# EAGLE design MotherboardRev1 (EAGLE 7.2.0)

## Sheet 1 of 9
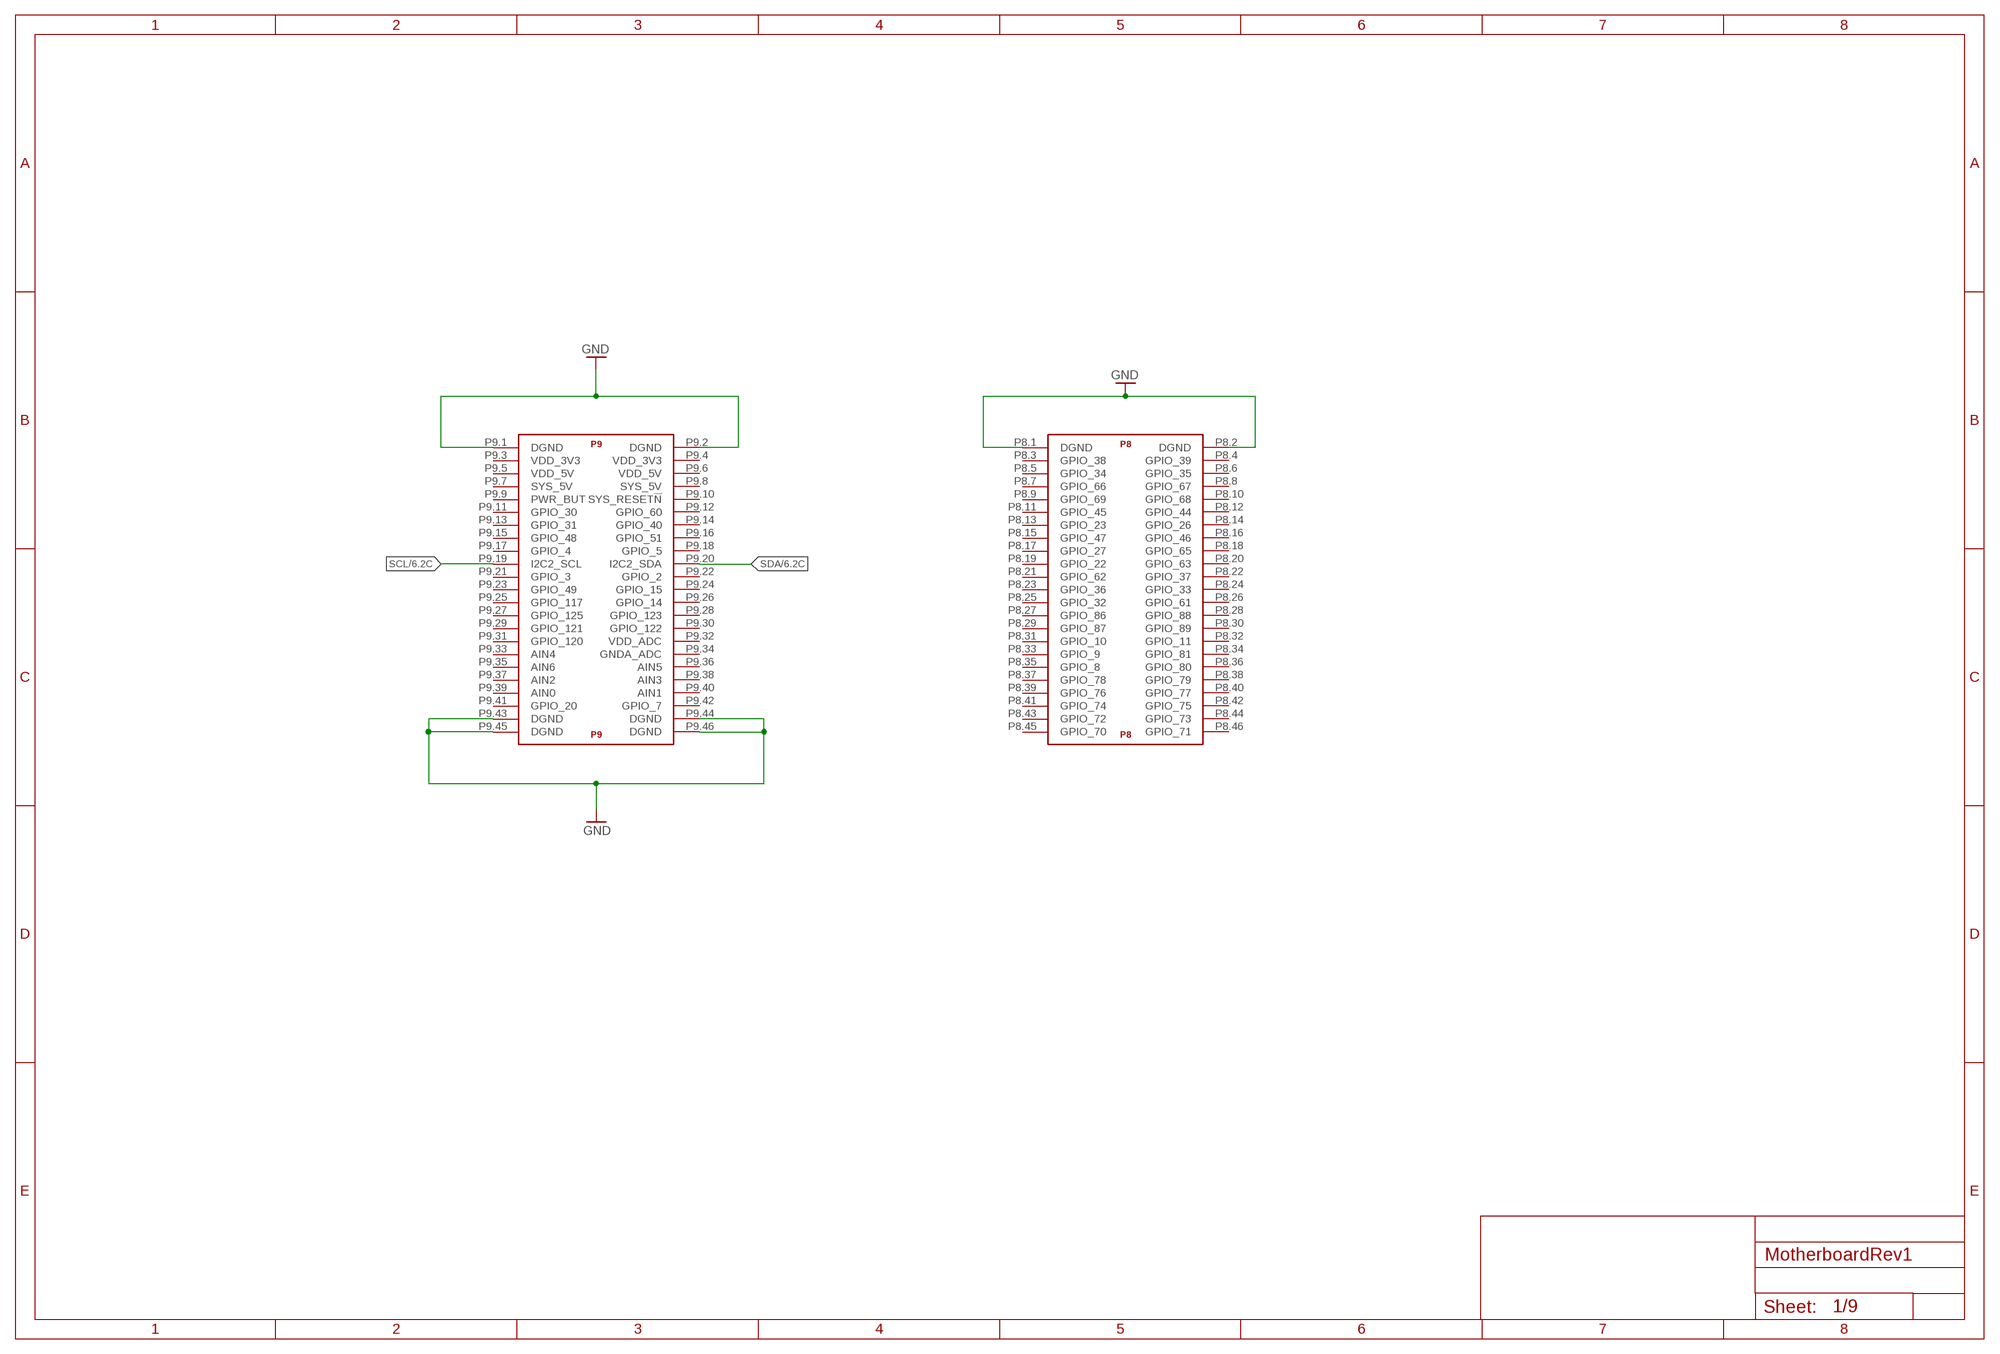
[diagram p0: schematic, sheet 1]

### Parts
U$1  BEAGLE_BONE_BLACK_CAPE  [BEAGLE_BONE_BLACK_CAPE]

### Nets
GND: U$1.P8.1(P8:DGND) U$1.P8.2(P8:DGND) U$1.P9.1(P9:DGND) U$1.P9.2(P9:DGND) U$1.P9.43(P9:DGND) U$1.P9.44(P9:DGND) U$1.P9.45(P9:DGND) U$1.P9.46(P9:DGND) ; also sheet 2,3,4,5,6,8,9
SCL: U$1.P9.19(P9:I2C2_SCL) ; also sheet 6,9
SDA: U$1.P9.20(P9:I2C2_SDA) ; also sheet 6,9
Unconnected: U$1.P8.3(P8:GPIO_38) U$1.P8.4(P8:GPIO_39) U$1.P8.5(P8:GPIO_34) U$1.P8.6(P8:GPIO_35) U$1.P8.7(P8:GPIO_66) U$1.P8.8(P8:GPIO_67) U$1.P8.9(P8:GPIO_69) U$1.P8.10(P8:GPIO_68) U$1.P8.11(P8:GPIO_45) U$1.P8.12(P8:GPIO_44) U$1.P8.13(P8:GPIO_23) U$1.P8.14(P8:GPIO_26) U$1.P8.15(P8:GPIO_47) U$1.P8.16(P8:GPIO_46) U$1.P8.17(P8:GPIO_27) U$1.P8.18(P8:GPIO_65) U$1.P8.19(P8:GPIO_22) U$1.P8.20(P8:GPIO_63) U$1.P8.21(P8:GPIO_62) U$1.P8.22(P8:GPIO_37) U$1.P8.23(P8:GPIO_36) U$1.P8.24(P8:GPIO_33) U$1.P8.25(P8:GPIO_32) U$1.P8.26(P8:GPIO_61) U$1.P8.27(P8:GPIO_86) U$1.P8.28(P8:GPIO_88) U$1.P8.29(P8:GPIO_87) U$1.P8.30(P8:GPIO_89) U$1.P8.31(P8:GPIO_10) U$1.P8.32(P8:GPIO_11) U$1.P8.33(P8:GPIO_9) U$1.P8.34(P8:GPIO_81) U$1.P8.35(P8:GPIO_8) U$1.P8.36(P8:GPIO_80) U$1.P8.37(P8:GPIO_78) U$1.P8.38(P8:GPIO_79) U$1.P8.39(P8:GPIO_76) U$1.P8.40(P8:GPIO_77) U$1.P8.41(P8:GPIO_74) U$1.P8.42(P8:GPIO_75) U$1.P8.43(P8:GPIO_72) U$1.P8.44(P8:GPIO_73) U$1.P8.45(P8:GPIO_70) U$1.P8.46(P8:GPIO_71) U$1.P9.3(P9:VDD_3V3) U$1.P9.4(P9:VDD_3V3) U$1.P9.5(P9:VDD_5V) U$1.P9.6(P9:VDD_5V) U$1.P9.7(P9:SYS_5V) U$1.P9.8(P9:SYS_5V) U$1.P9.9(P9:PWR_BUT) U$1.P9.10(P9:SYS_RESET!N) U$1.P9.11(P9:GPIO_30) U$1.P9.12(P9:GPIO_60) U$1.P9.13(P9:GPIO_31) U$1.P9.14(P9:GPIO_40) U$1.P9.15(P9:GPIO_48) U$1.P9.16(P9:GPIO_51) U$1.P9.17(P9:GPIO_4) U$1.P9.18(P9:GPIO_5) U$1.P9.21(P9:GPIO_3) U$1.P9.22(P9:GPIO_2) U$1.P9.23(P9:GPIO_49) U$1.P9.24(P9:GPIO_15) U$1.P9.25(P9:GPIO_117) U$1.P9.26(P9:GPIO_14) U$1.P9.27(P9:GPIO_125) U$1.P9.28(P9:GPIO_123) U$1.P9.29(P9:GPIO_121) U$1.P9.30(P9:GPIO_122) U$1.P9.31(P9:GPIO_120) U$1.P9.32(P9:VDD_ADC) U$1.P9.33(P9:AIN4) U$1.P9.34(P9:GNDA_ADC) U$1.P9.35(P9:AIN6) U$1.P9.36(P9:AIN5) U$1.P9.37(P9:AIN2) U$1.P9.38(P9:AIN3) U$1.P9.39(P9:AIN0) U$1.P9.40(P9:AIN1) U$1.P9.41(P9:GPIO_20) U$1.P9.42(P9:GPIO_7)

## Sheet 2 of 9
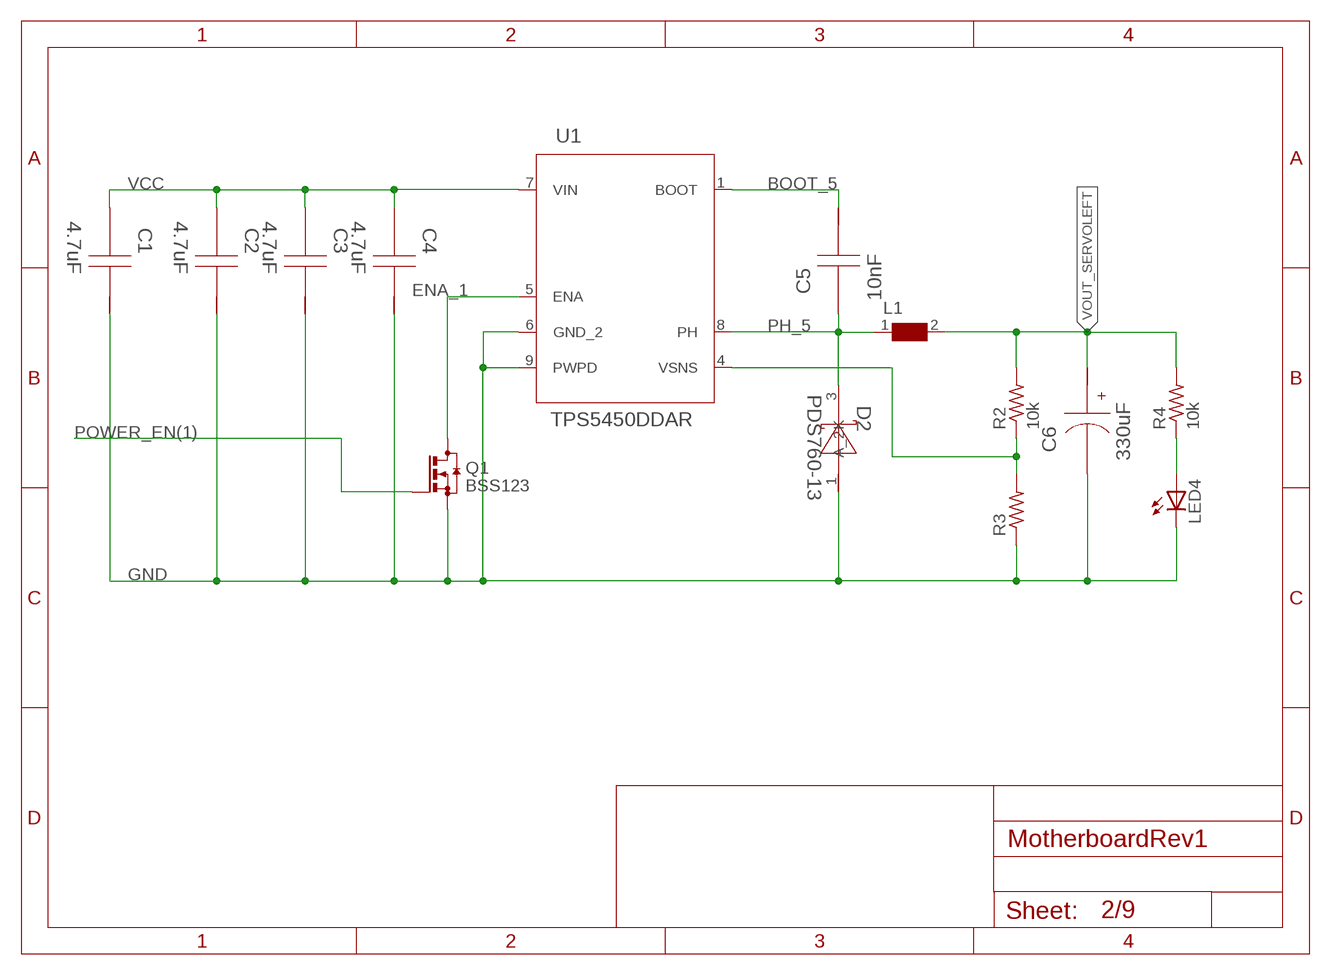
[diagram p1: schematic, sheet 2]

### Parts
C1  4.7uF  GRM31CR71H475KA12L  [1206]
C2  4.7uF  GRM31CR71H475KA12L  [1206]
C3  4.7uF  GRM31CR71H475KA12L  [1206]
C4  4.7uF  GRM31CR71H475KA12L  [1206]
C5  10nF  C0805C103K5RACTU  [0805]
C6  330uF  10SVP330MX  [SM_RADIAL_10AMM]
D2  PDS760-13  [POWERDI5]
L1  WE-HCC-7443331000_1090  [WE-HCC_1090]
LED4  LEDSML1206  [SML1206]
Q1  BSS123  [SOT23]
R2  10k  R-US_R1206  [R1206]
R3  R-US_R1206  [R1206]
R4  10k  R-US_R1206  [R1206]
U1  TPS5450DDAR  [R-PDSO-G8]

### Nets
BOOT_5: C5.1 U1.1(BOOT) ; also sheet 4
ENA_1: Q1.3(D) U1.5(ENA)
GND: C1.1 C2.1 C3.1 C4.1 C6.2(-) D2.1(A_2) LED4.C Q1.2(S) R3.1 U1.6(GND_2) U1.9(PWPD) ; also sheet 1,3,4,5,6,8,9
N$2: LED4.A R4.1
PH_5: C5.2 D2.3(K) L1.1 U1.8(PH) ; also sheet 4
POWER_EN(1): Q1.1(G)
VCC: C1.2 C2.2 C3.2 C4.2 U1.7(VIN) ; also sheet 3,4,5
VOUT_SERVOLEFT: C6.1(+) L1.2 R2.2 R4.2 ; also sheet 8
VSNS_5: R2.1 R3.2 U1.4(VSNS)

## Sheet 3 of 9
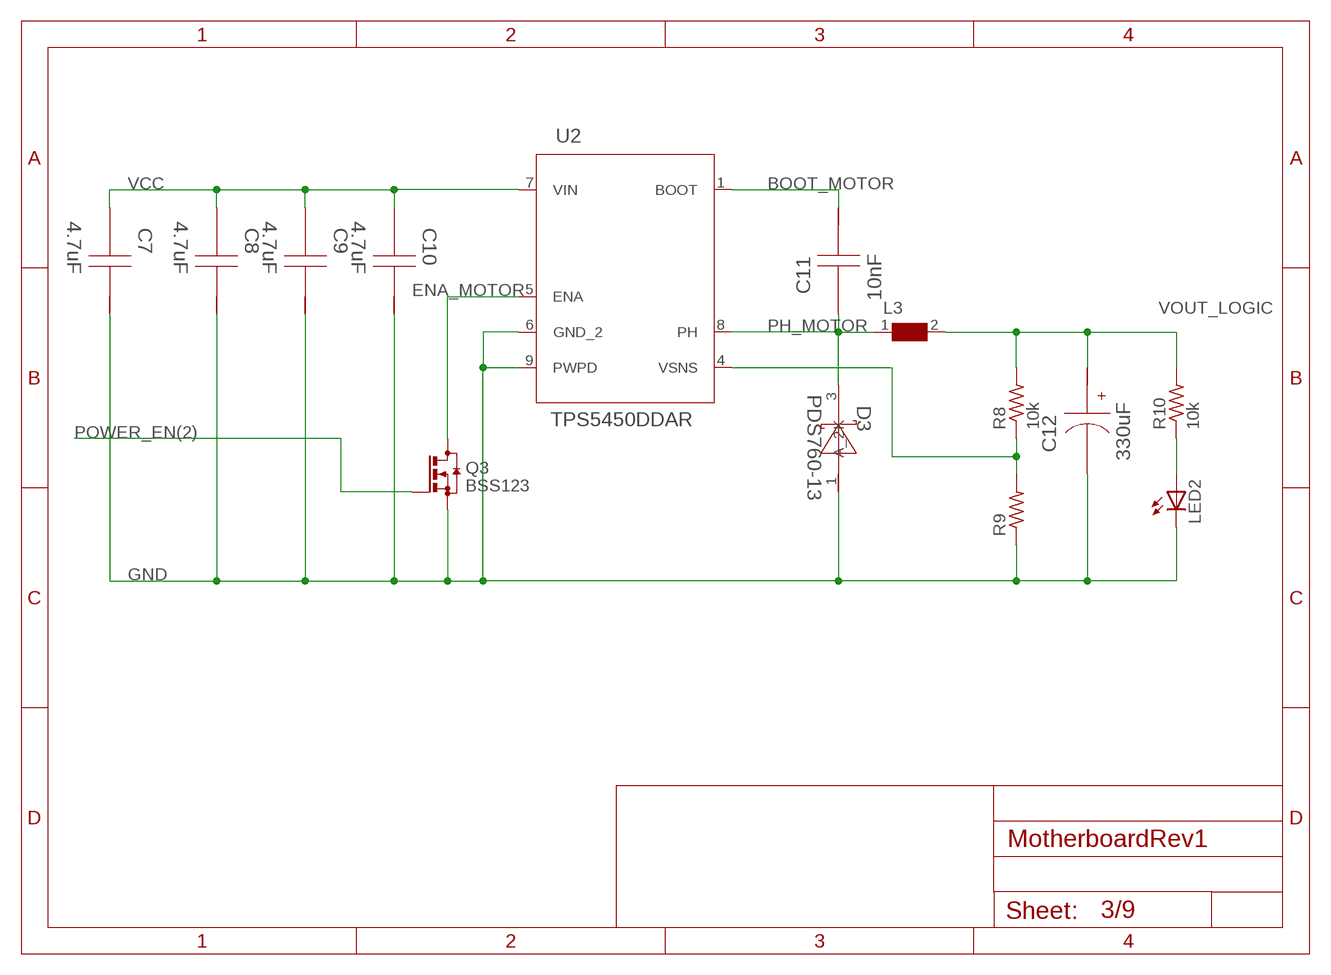
[diagram p2: schematic, sheet 3]

### Parts
C7  4.7uF  GRM31CR71H475KA12L  [1206]
C8  4.7uF  GRM31CR71H475KA12L  [1206]
C9  4.7uF  GRM31CR71H475KA12L  [1206]
C10  4.7uF  GRM31CR71H475KA12L  [1206]
C11  10nF  C0805C103K5RACTU  [0805]
C12  330uF  10SVP330MX  [SM_RADIAL_10AMM]
D3  PDS760-13  [POWERDI5]
L3  WE-HCC-7443331000_1090  [WE-HCC_1090]
LED2  LEDSML1206  [SML1206]
Q3  BSS123  [SOT23]
R8  10k  R-US_R1206  [R1206]
R9  R-US_R1206  [R1206]
R10  10k  R-US_R1206  [R1206]
U2  TPS5450DDAR  [R-PDSO-G8]

### Nets
BOOT_MOTOR: C11.1 U2.1(BOOT) ; also sheet 5
ENA_MOTOR: Q3.3(D) U2.5(ENA) ; also sheet 5
GND: C7.1 C8.1 C9.1 C10.1 C12.2(-) D3.1(A_2) LED2.C Q3.2(S) R9.1 U2.6(GND_2) U2.9(PWPD) ; also sheet 1,2,4,5,6,8,9
N$4: LED2.A R10.1
PH_MOTOR: C11.2 D3.3(K) L3.1 U2.8(PH) ; also sheet 5
POWER_EN(2): Q3.1(G)
VCC: C7.2 C8.2 C9.2 C10.2 U2.7(VIN) ; also sheet 2,4,5
VOUT_LOGIC: C12.1(+) L3.2 R8.2 R10.2
VSNS1_MOTOR: R8.1 R9.2 U2.4(VSNS)

## Sheet 4 of 9
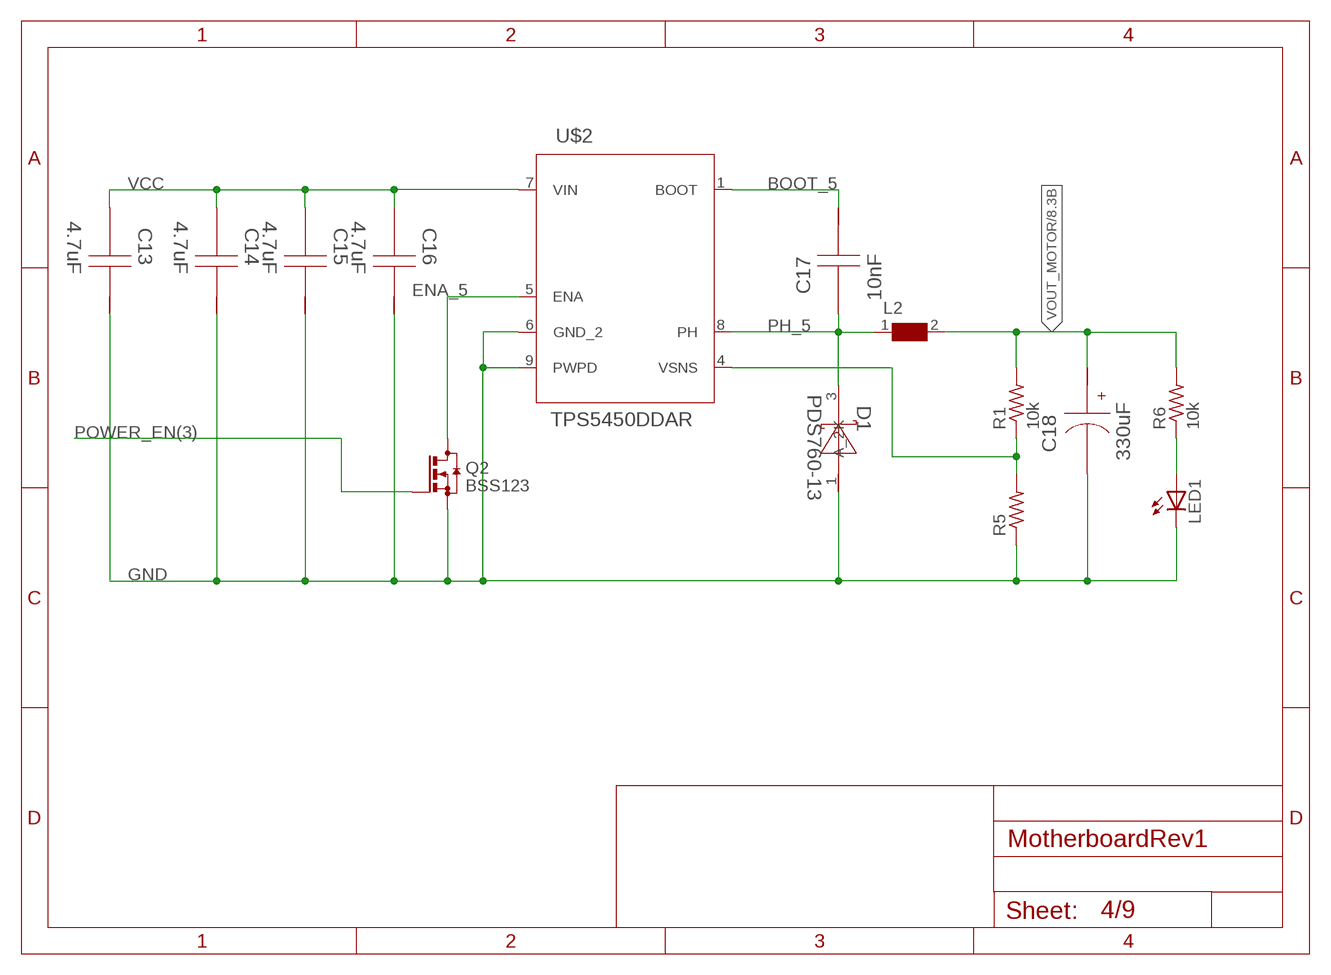
[diagram p3: schematic, sheet 4]

### Parts
C13  4.7uF  GRM31CR71H475KA12L  [1206]
C14  4.7uF  GRM31CR71H475KA12L  [1206]
C15  4.7uF  GRM31CR71H475KA12L  [1206]
C16  4.7uF  GRM31CR71H475KA12L  [1206]
C17  10nF  C0805C103K5RACTU  [0805]
C18  330uF  10SVP330MX  [SM_RADIAL_10AMM]
D1  PDS760-13  [POWERDI5]
L2  WE-HCC-7443331000_1090  [WE-HCC_1090]
LED1  LEDSML1206  [SML1206]
Q2  BSS123  [SOT23]
R1  10k  R-US_R1206  [R1206]
R5  R-US_R1206  [R1206]
R6  10k  R-US_R1206  [R1206]
U$2  TPS5450DDAR  [R-PDSO-G8]

### Nets
BOOT_5: C17.1 U$2.1(BOOT) ; also sheet 2
ENA_5: Q2.3(D) U$2.5(ENA)
GND: C13.1 C14.1 C15.1 C16.1 C18.2(-) D1.1(A_2) LED1.C Q2.2(S) R5.1 U$2.6(GND_2) U$2.9(PWPD) ; also sheet 1,2,3,5,6,8,9
N$1: LED1.A R6.1
PH_5: C17.2 D1.3(K) L2.1 U$2.8(PH) ; also sheet 2
POWER_EN(3): Q2.1(G)
VCC: C13.2 C14.2 C15.2 C16.2 U$2.7(VIN) ; also sheet 2,3,5
VOUT_MOTOR: C18.1(+) L2.2 R1.2 R6.2 ; also sheet 8
VSNS_1: R1.1 R5.2 U$2.4(VSNS)

## Sheet 5 of 9
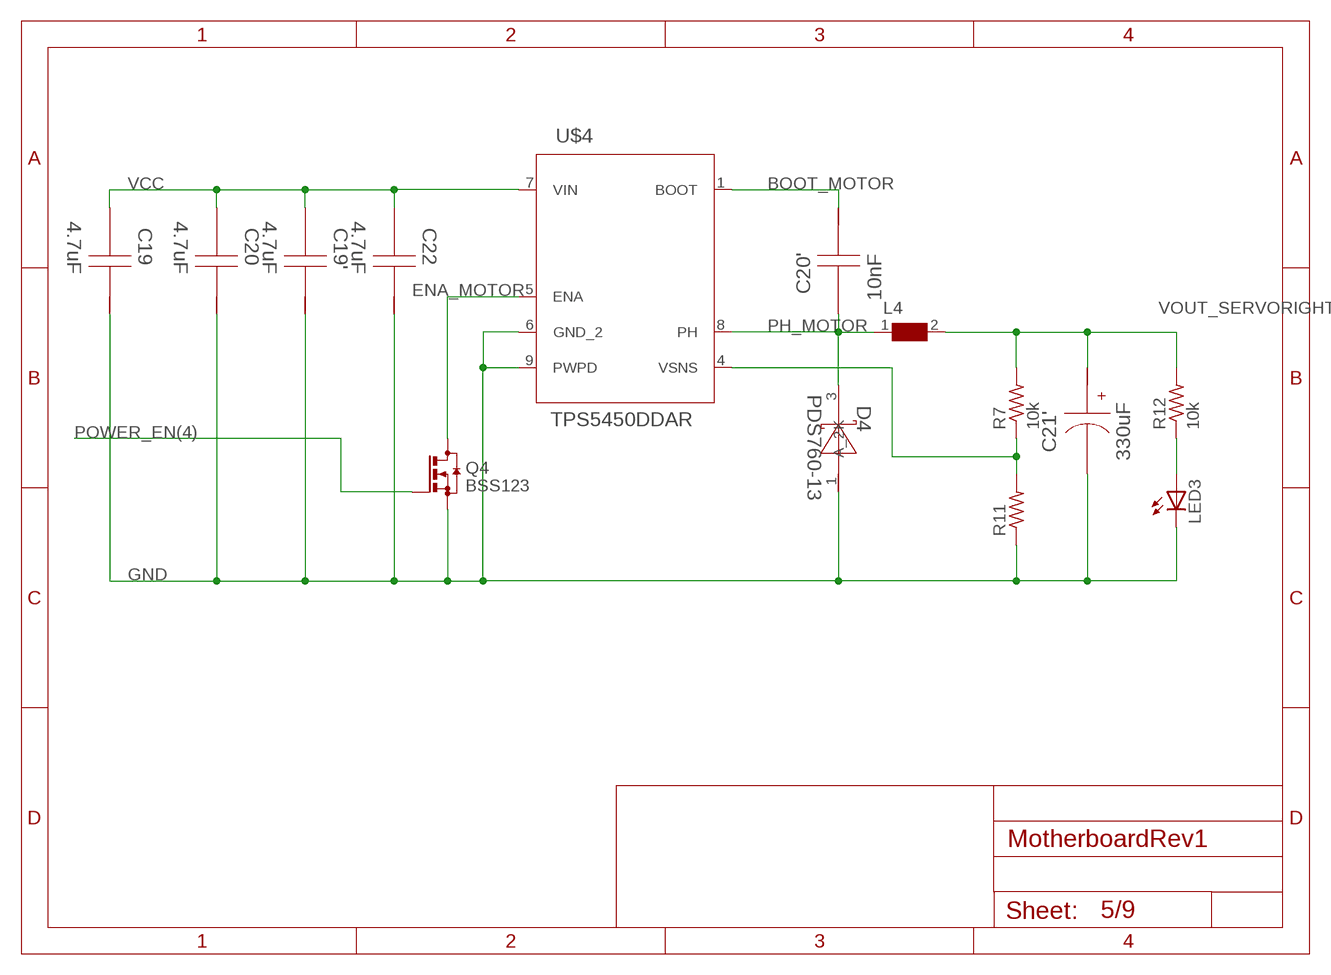
[diagram p4: schematic, sheet 5]

### Parts
C19  4.7uF  GRM31CR71H475KA12L  [1206]
C19'  4.7uF  GRM31CR71H475KA12L  [1206]
C20  4.7uF  GRM31CR71H475KA12L  [1206]
C20'  10nF  C0805C103K5RACTU  [0805]
C21'  330uF  10SVP330MX  [SM_RADIAL_10AMM]
C22  4.7uF  GRM31CR71H475KA12L  [1206]
D4  PDS760-13  [POWERDI5]
L4  WE-HCC-7443331000_1090  [WE-HCC_1090]
LED3  LEDSML1206  [SML1206]
Q4  BSS123  [SOT23]
R7  10k  R-US_R1206  [R1206]
R11  R-US_R1206  [R1206]
R12  10k  R-US_R1206  [R1206]
U$4  TPS5450DDAR  [R-PDSO-G8]

### Nets
BOOT_MOTOR: C20'.1 U$4.1(BOOT) ; also sheet 3
ENA_MOTOR: Q4.3(D) U$4.5(ENA) ; also sheet 3
GND: C19'.1 C19.1 C20.1 C21'.2(-) C22.1 D4.1(A_2) LED3.C Q4.2(S) R11.1 U$4.6(GND_2) U$4.9(PWPD) ; also sheet 1,2,3,4,6,8,9
N$3: LED3.A R12.1
PH_MOTOR: C20'.2 D4.3(K) L4.1 U$4.8(PH) ; also sheet 3
POWER_EN(4): Q4.1(G)
VCC: C19'.2 C19.2 C20.2 C22.2 U$4.7(VIN) ; also sheet 2,3,4
VOUT_SERVORIGHT: C21'.1(+) L4.2 R7.2 R12.2 ; also sheet 8
VSNS1_MOTOR1: R7.1 R11.2 U$4.4(VSNS)

## Sheet 6 of 9
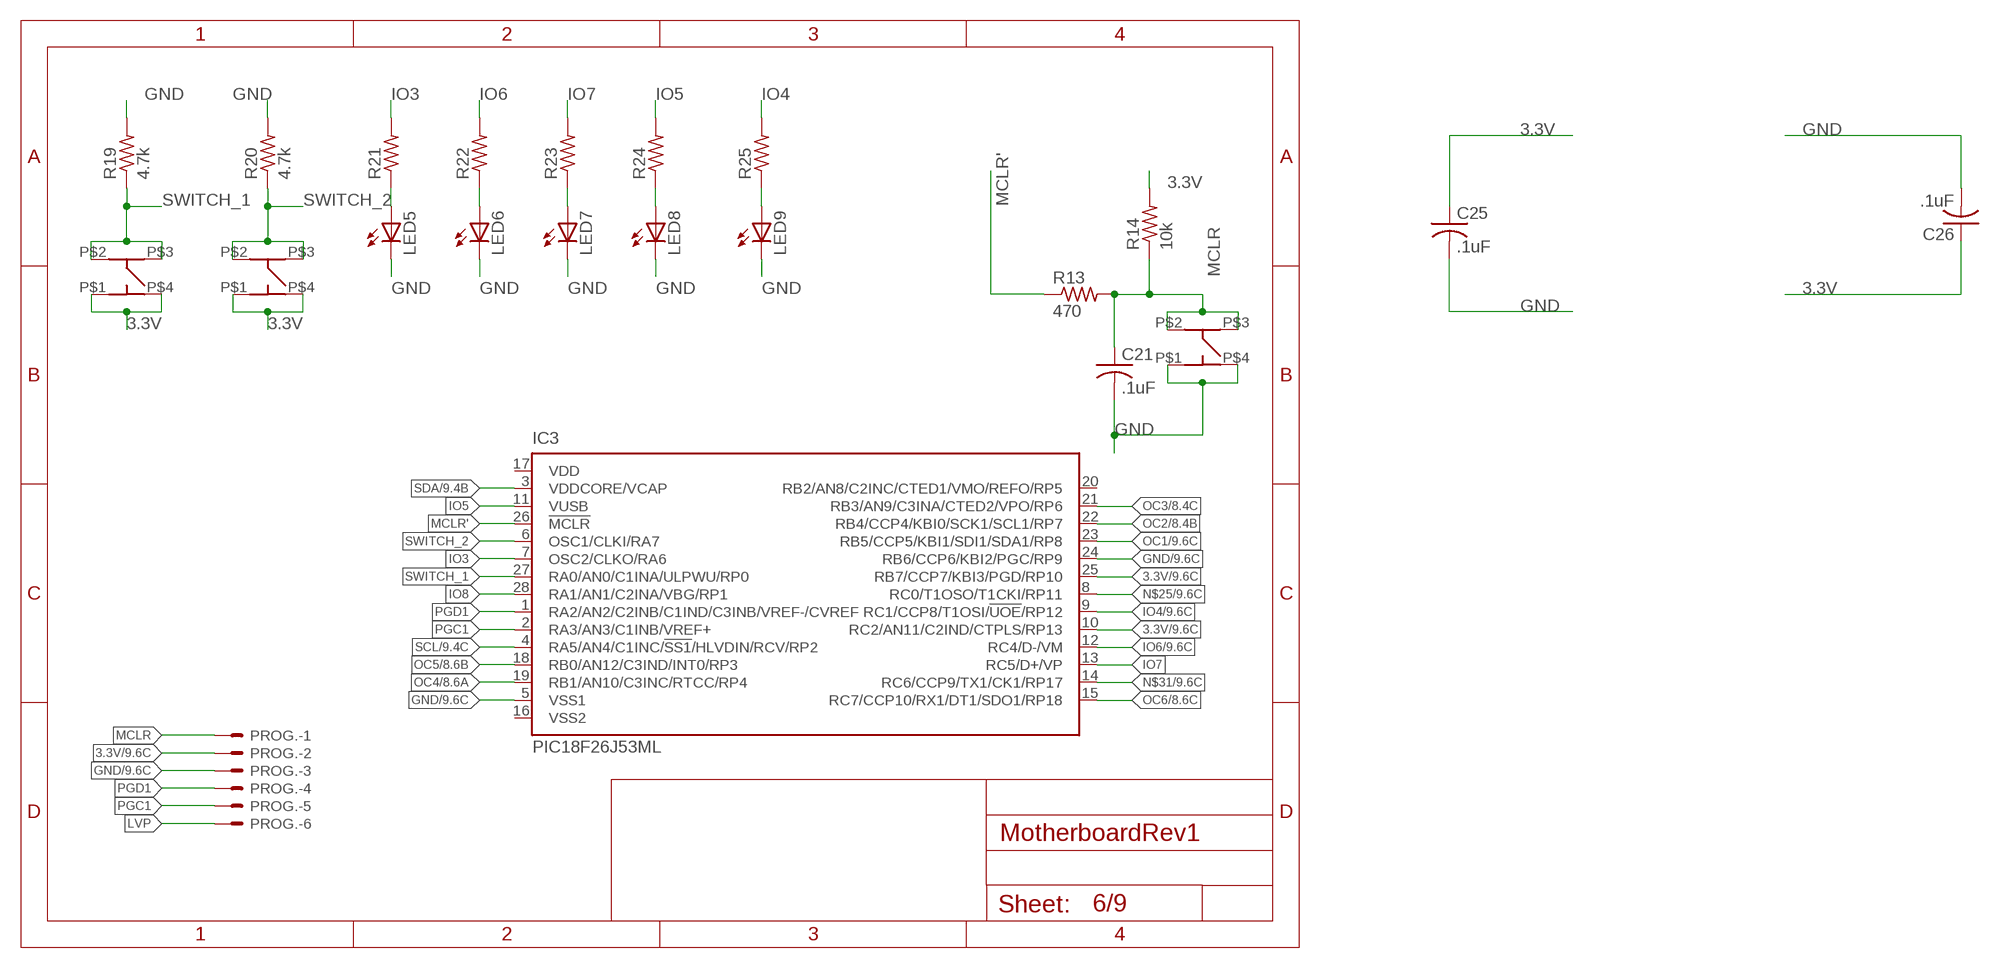
[diagram p5: schematic, sheet 6]

### Parts
C21  .1uF  C-USC0805  [C0805]
C25  .1uF  C-USC0805  [C0805]
C26  .1uF  C-USC0805  [C0805]
IC3  PIC18F26J53ML  [QFN28-ML_6X6MM]
LED5  LED_LEDCHIPLED_1206  [LED_CHIPLED_1206]
LED6  LED_LEDCHIPLED_1206  [LED_CHIPLED_1206]
LED7  LED_LEDCHIPLED_1206  [LED_CHIPLED_1206]
LED8  LED_LEDCHIPLED_1206  [LED_CHIPLED_1206]
LED9  LED_LEDCHIPLED_1206  [LED_CHIPLED_1206]
PROG.  22-23-2061  [22-23-2061]
R13  470  R-US_R0805  [R0805]
R14  10k  R-US_R0805  [R0805]
R19  4.7k  R-US_R0805  [R0805]
R20  4.7k  R-US_R0805  [R0805]
R21  R-US_M0805  [M0805]
R22  R-US_M0805  [M0805]
R23  R-US_M0805  [M0805]
R24  R-US_M0805  [M0805]
R25  R-US_M0805  [M0805]
U$5  Switch3  MC32882_SW  [MC32882_FINAL]
U$6  Switch1  MC32882_SW  [MC32882_FINAL]
U$7  Switch2  MC32882_SW  [MC32882_FINAL]

### Nets
3.3V: C25.1 C26.1 IC3.10(RC2/AN11/C2IND/CTPLS/RP13) IC3.25(RB7/CCP7/KBI3/PGD/RP10) PROG..2 R14.2 U$6.P$1(P1) U$6.P$4(P4) U$7.P$1(P1) U$7.P$4(P4) ; also sheet 7,9
GND: C21.2 C25.2 C26.2 IC3.5(VSS1) IC3.24(RB6/CCP6/KBI2/PGC/RP9) LED5.C LED6.C LED7.C LED8.C LED9.C PROG..3 R19.2 R20.2 U$5.P$1(P1) U$5.P$4(P4) ; also sheet 1,2,3,4,5,8,9
IO3: IC3.7(OSC2/CLKO/RA6) R21.2
IO4: IC3.9(RC1/CCP8/T1OSI/!UOE!/RP12) R25.2 ; also sheet 9
IO5: IC3.11(VUSB) R24.2
IO6: IC3.12(RC4/D-/VM) R22.2 ; also sheet 9
IO7: IC3.13(RC5/D+/VP) R23.2
IO8: IC3.28(RA1/AN1/C2INA/VBG/RP1)
LVP: PROG..6
MCLR: C21.1 PROG..1 R13.2 R14.1 U$5.P$2(P2) U$5.P$3(P3)
MCLR': IC3.26(!MCLR) R13.1
N$5: LED5.A R21.1
N$6: LED6.A R22.1
N$7: LED7.A R23.1
N$8: LED8.A R24.1
N$9: LED9.A R25.1
N$25: IC3.8(RC0/T1OSO/T1CKI/RP11) ; also sheet 9
N$31: IC3.14(RC6/CCP9/TX1/CK1/RP17) ; also sheet 9
OC1: IC3.23(RB5/CCP5/KBI1/SDI1/SDA1/RP8) ; also sheet 8,9
OC2: IC3.22(RB4/CCP4/KBI0/SCK1/SCL1/RP7) ; also sheet 8,9
OC3: IC3.21(RB3/AN9/C3INA/CTED2/VPO/RP6) ; also sheet 8,9
OC4: IC3.19(RB1/AN10/C3INC/RTCC/RP4) ; also sheet 8
OC5: IC3.18(RB0/AN12/C3IND/INT0/RP3) ; also sheet 8
OC6: IC3.15(RC7/CCP10/RX1/DT1/SDO1/RP18) ; also sheet 8
PGC1: IC3.2(RA3/AN3/C1INB/VREF+) PROG..5
PGD1: IC3.1(RA2/AN2/C2INB/C1IND/C3INB/VREF-/CVREF) PROG..4
SCL: IC3.4(RA5/AN4/C1INC/!SS1!/HLVDIN/RCV/RP2) ; also sheet 1,9
SDA: IC3.3(VDDCORE/VCAP) ; also sheet 1,9
SWITCH_1: IC3.27(RA0/AN0/C1INA/ULPWU/RP0) R19.1 U$6.P$2(P2) U$6.P$3(P3)
SWITCH_2: IC3.6(OSC1/CLKI/RA7) R20.1 U$7.P$2(P2) U$7.P$3(P3)
Unconnected: IC3.16(VSS2) IC3.17(VDD) IC3.20(RB2/AN8/C2INC/CTED1/VMO/REFO/RP5)

## Sheet 7 of 9: Power System
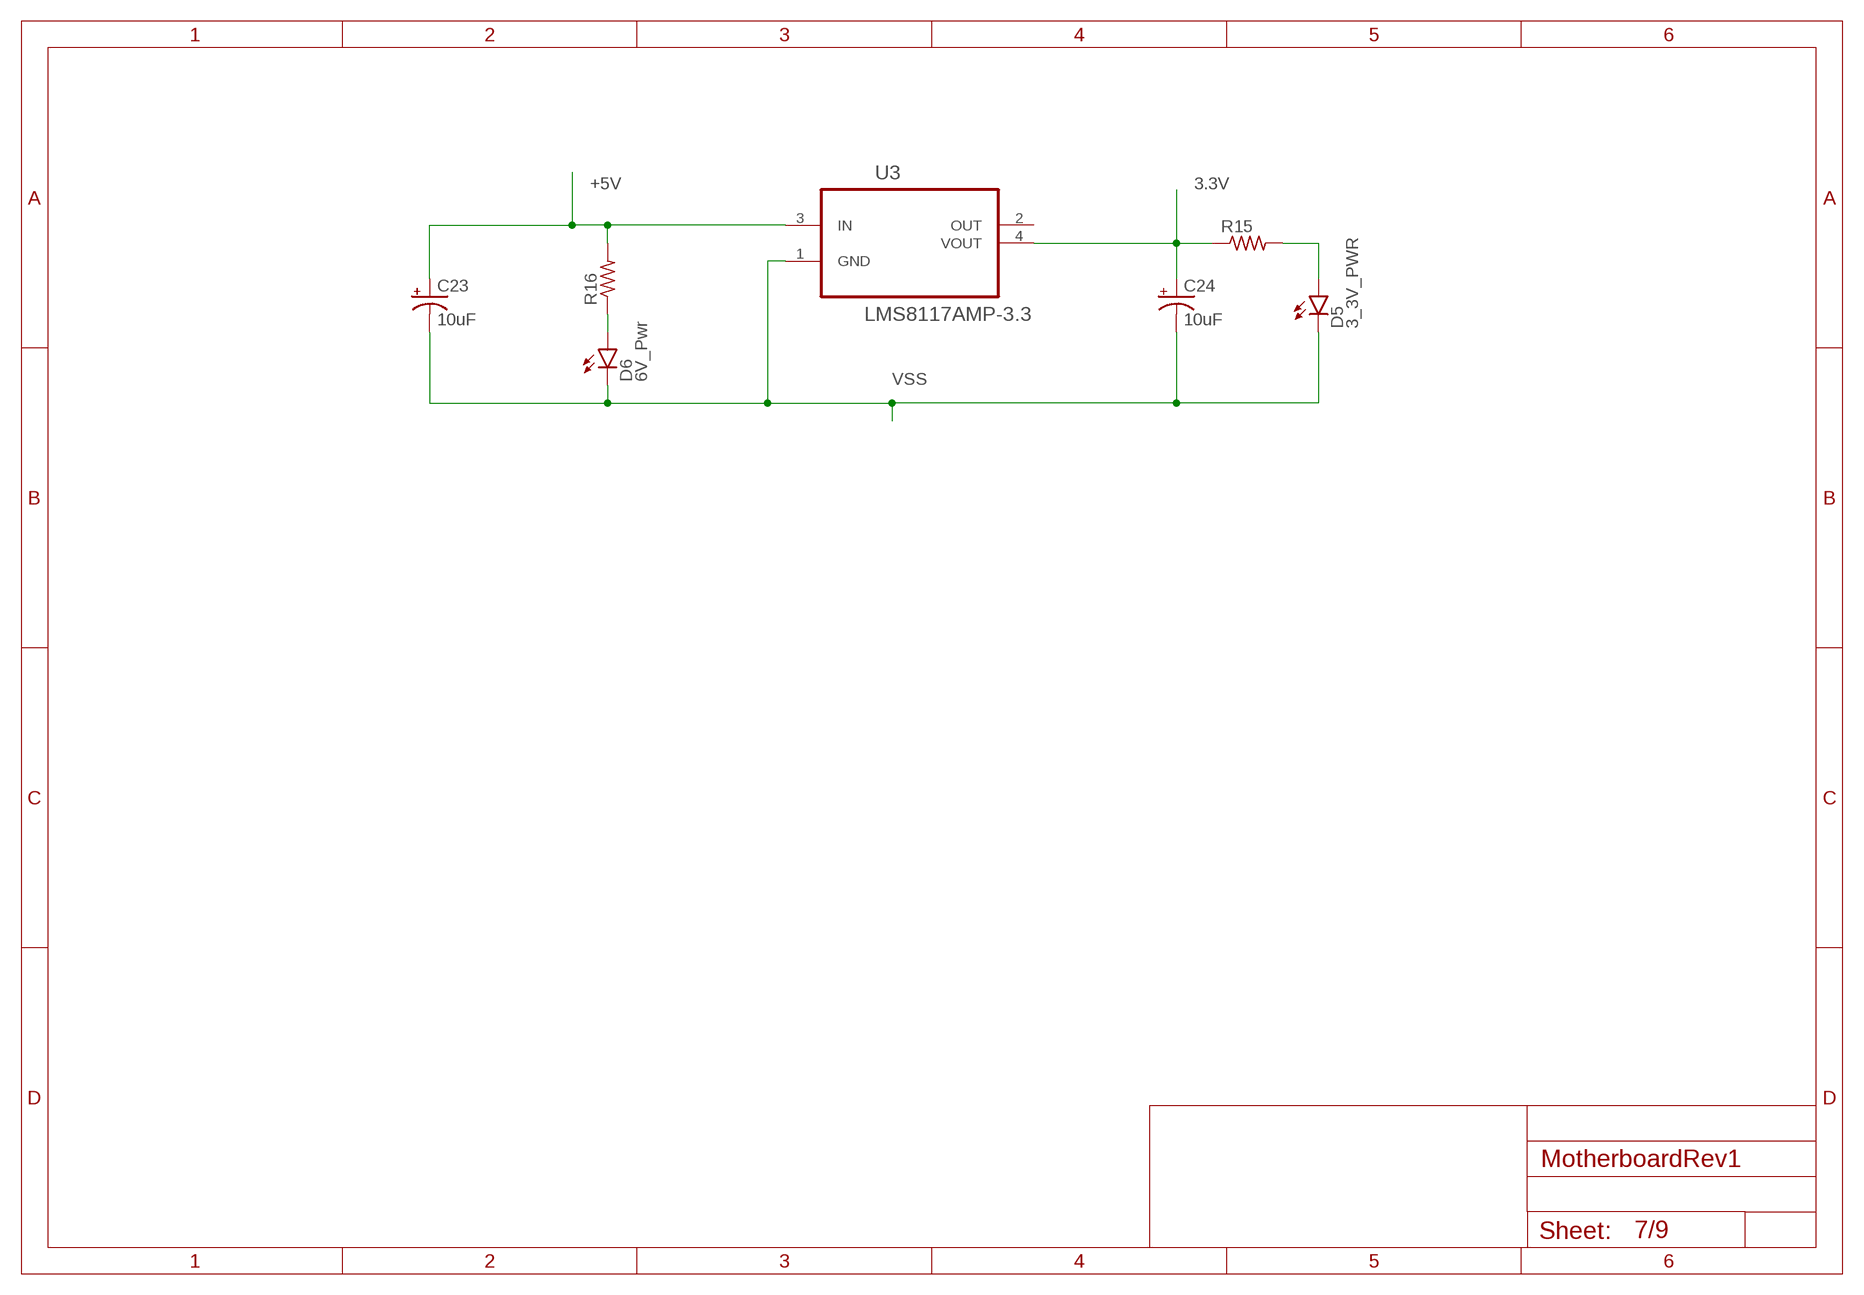
[diagram p6: schematic, sheet 7]

### Parts
C23  10uF  10UF-16V-10%(TANT)  [EIA3216]
C24  10uF  10UF-16V-10%(TANT)  [EIA3216]
D5  3_3V_PWR  LED-FKIT-1206  [FKIT-LED-1206]
D6  6V_Pwr  LED-FKIT-1206  [FKIT-LED-1206]
R15  R-US_R0805W  [R0805W]
R16  R-US_R0805W  [R0805W]
U3  LMS8117AMP-3.3  [SOT230P696X180-4N]

### Nets
3.3V: C24.A(+) R15.1 U3.4(VOUT) ; also sheet 6,9
+5V: C23.A(+) R16.2 U3.3(IN)
N$10: D5.A R15.2
N$13: D6.A R16.1
VSS: C23.C(-) C24.C(-) D5.C D6.C U3.1(GND) ; also sheet 8
Unconnected: U3.2(OUT)

## Sheet 8 of 9
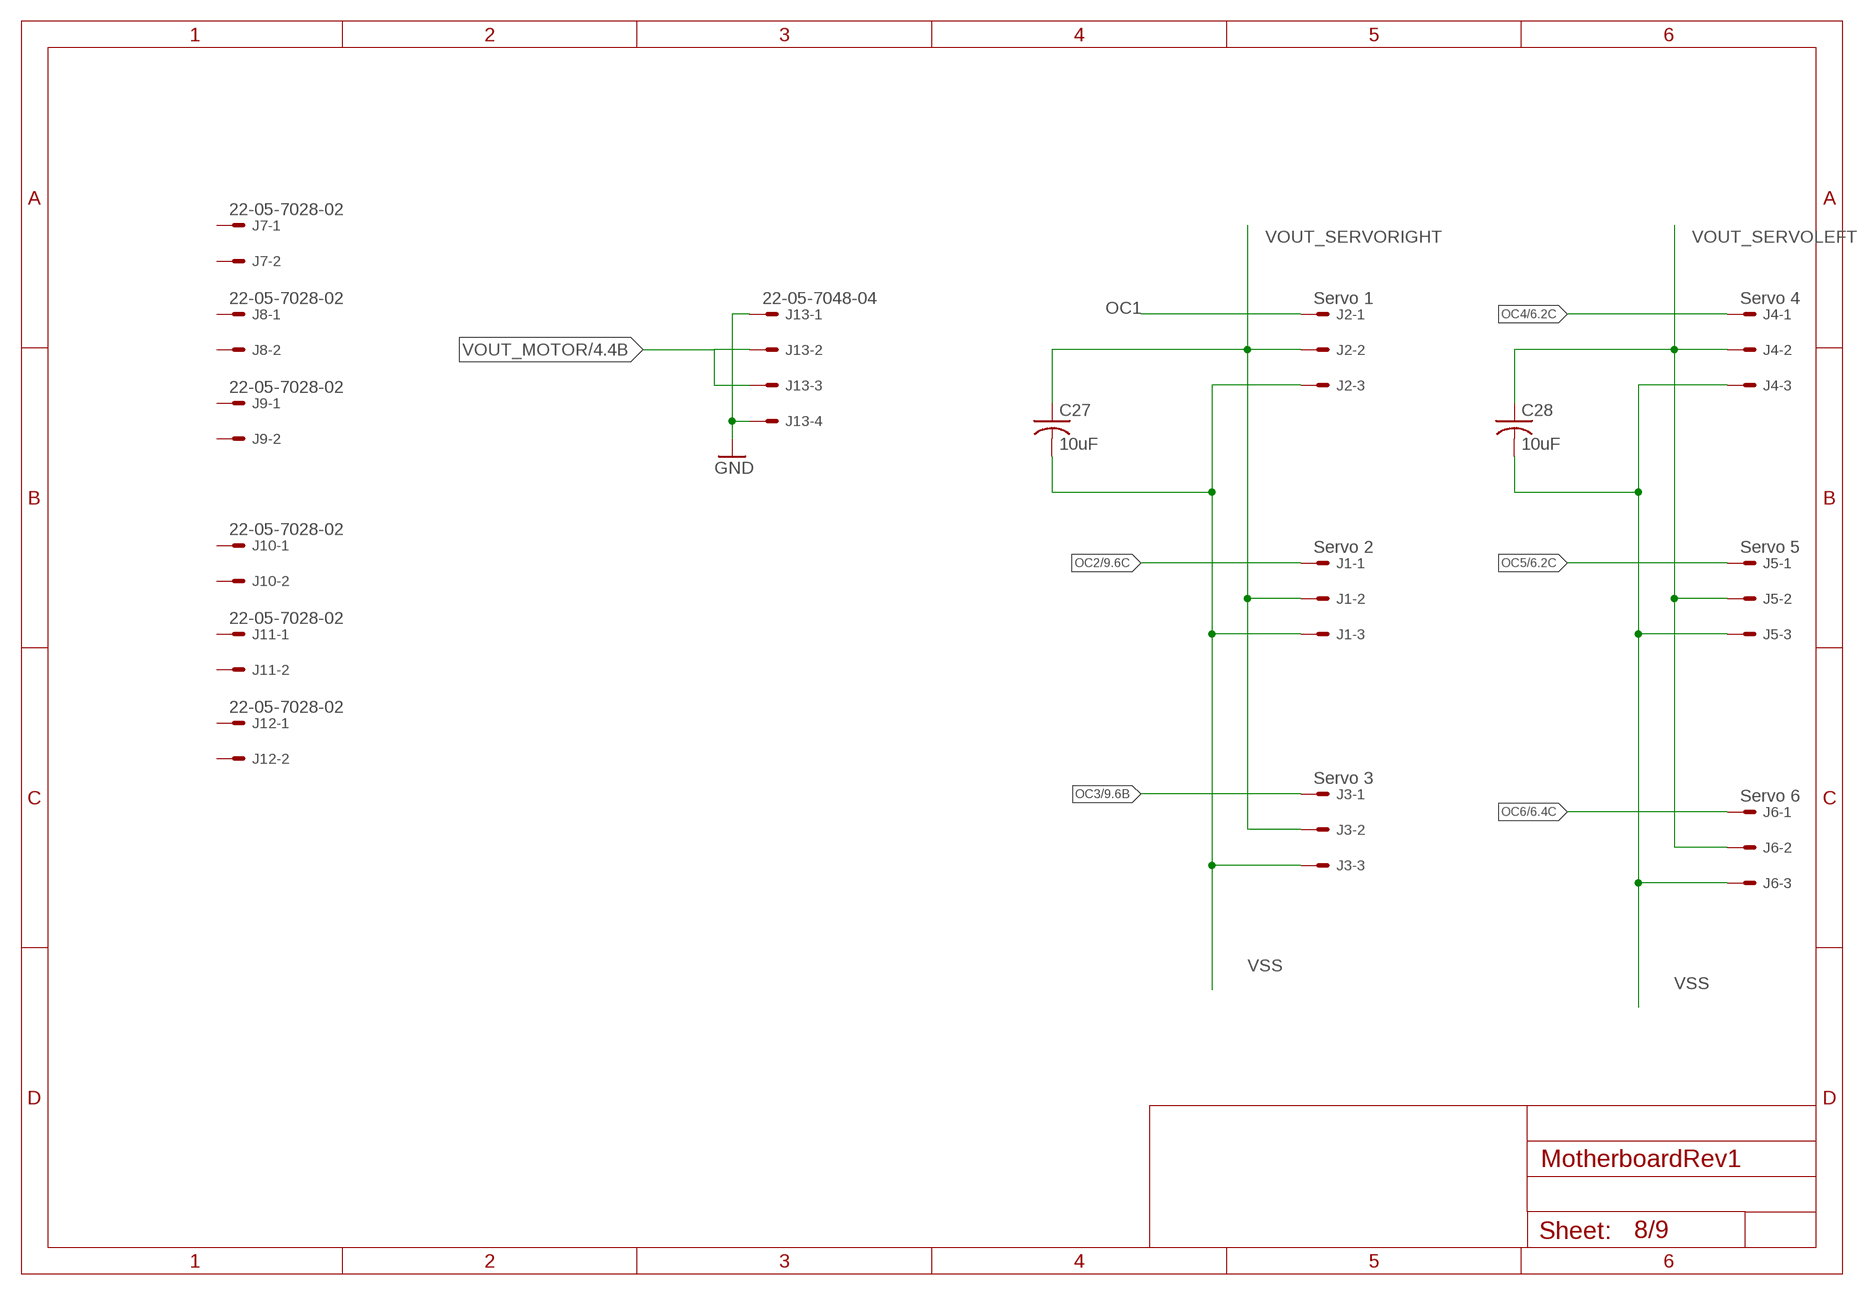
[diagram p7: schematic, sheet 8]

### Parts
C27  10uF  C-USC0805  [C0805]
C28  10uF  C-USC0805  [C0805]
J1  Servo 2  22-05-7038-03  [7395-03]
J2  Servo 1  22-05-7038-03  [7395-03]
J3  Servo 3  22-05-7038-03  [7395-03]
J4  Servo 4  22-05-7038-03  [7395-03]
J5  Servo 5  22-05-7038-03  [7395-03]
J6  Servo 6  22-05-7038-03  [7395-03]
J7  22-05-7028-02  [7395-02]
J8  22-05-7028-02  [7395-02]
J9  22-05-7028-02  [7395-02]
J10  22-05-7028-02  [7395-02]
J11  22-05-7028-02  [7395-02]
J12  22-05-7028-02  [7395-02]
J13  22-05-7048-04  [7395-04]

### Nets
GND: J13.1 J13.4 ; also sheet 1,2,3,4,5,6,9
OC1: J2.1 ; also sheet 6,9
OC2: J1.1 ; also sheet 6,9
OC3: J3.1 ; also sheet 6,9
OC4: J4.1 ; also sheet 6
OC5: J5.1 ; also sheet 6
OC6: J6.1 ; also sheet 6
VOUT_MOTOR: J13.2 J13.3 ; also sheet 4
VOUT_SERVOLEFT: C28.1 J4.2 J5.2 J6.2 ; also sheet 2
VOUT_SERVORIGHT: C27.1 J1.2 J2.2 J3.2 ; also sheet 5
VSS: C27.2 C28.2 J1.3 J2.3 J3.3 J4.3 J5.3 J6.3 ; also sheet 7
Unconnected: J7.1 J7.2 J8.1 J8.2 J9.1 J9.2 J10.1 J10.2 J11.1 J11.2 J12.1 J12.2

## Sheet 9 of 9
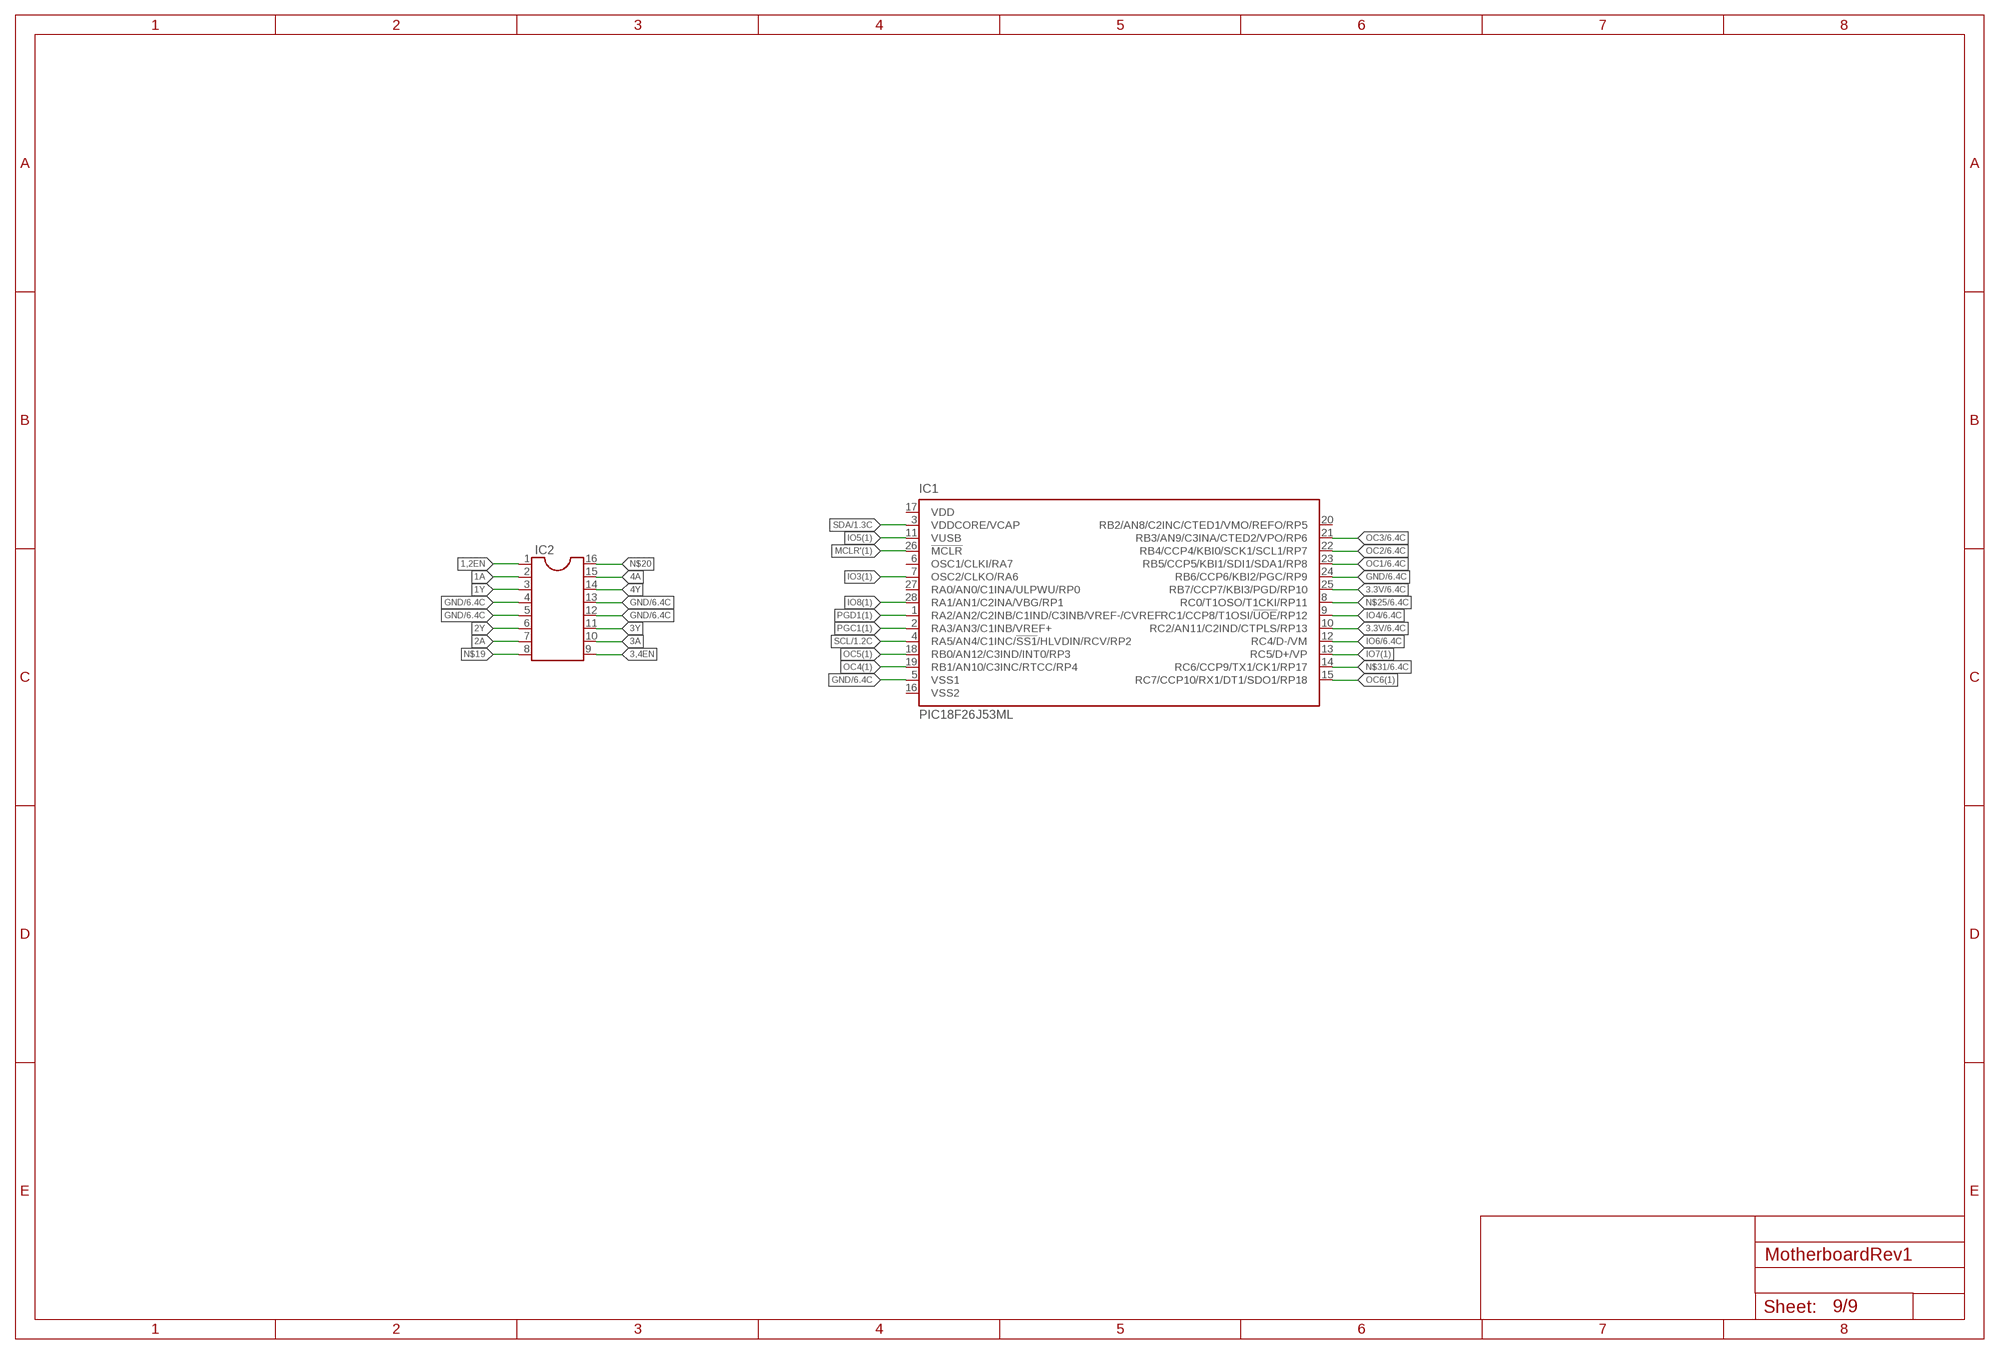
[diagram p8: schematic, sheet 9]

### Parts
IC1  PIC18F26J53ML  [QFN28-ML_6X6MM]
IC2  DIL16  [DIL16]

### Nets
1,2EN: IC2.1
1A: IC2.2
1Y: IC2.3
2A: IC2.7
2Y: IC2.6
3,4EN: IC2.9
3.3V: IC1.10(RC2/AN11/C2IND/CTPLS/RP13) IC1.25(RB7/CCP7/KBI3/PGD/RP10) ; also sheet 6,7
3A: IC2.10
3Y: IC2.11
4A: IC2.15
4Y: IC2.14
GND: IC1.5(VSS1) IC1.24(RB6/CCP6/KBI2/PGC/RP9) IC2.4 IC2.5 IC2.12 IC2.13 ; also sheet 1,2,3,4,5,6,8
IO3(1): IC1.7(OSC2/CLKO/RA6)
IO4: IC1.9(RC1/CCP8/T1OSI/!UOE!/RP12) ; also sheet 6
IO5(1): IC1.11(VUSB)
IO6: IC1.12(RC4/D-/VM) ; also sheet 6
IO7(1): IC1.13(RC5/D+/VP)
IO8(1): IC1.28(RA1/AN1/C2INA/VBG/RP1)
MCLR'(1): IC1.26(!MCLR)
N$19: IC2.8
N$20: IC2.16
N$25: IC1.8(RC0/T1OSO/T1CKI/RP11) ; also sheet 6
N$31: IC1.14(RC6/CCP9/TX1/CK1/RP17) ; also sheet 6
OC1: IC1.23(RB5/CCP5/KBI1/SDI1/SDA1/RP8) ; also sheet 6,8
OC2: IC1.22(RB4/CCP4/KBI0/SCK1/SCL1/RP7) ; also sheet 6,8
OC3: IC1.21(RB3/AN9/C3INA/CTED2/VPO/RP6) ; also sheet 6,8
OC4(1): IC1.19(RB1/AN10/C3INC/RTCC/RP4)
OC5(1): IC1.18(RB0/AN12/C3IND/INT0/RP3)
OC6(1): IC1.15(RC7/CCP10/RX1/DT1/SDO1/RP18)
PGC1(1): IC1.2(RA3/AN3/C1INB/VREF+)
PGD1(1): IC1.1(RA2/AN2/C2INB/C1IND/C3INB/VREF-/CVREF)
SCL: IC1.4(RA5/AN4/C1INC/!SS1!/HLVDIN/RCV/RP2) ; also sheet 1,6
SDA: IC1.3(VDDCORE/VCAP) ; also sheet 1,6
Unconnected: IC1.6(OSC1/CLKI/RA7) IC1.16(VSS2) IC1.17(VDD) IC1.20(RB2/AN8/C2INC/CTED1/VMO/REFO/RP5) IC1.27(RA0/AN0/C1INA/ULPWU/RP0)

## Library data of the parts
C1-C4 C7-C10 C13-C16 C19 C19' C20 C22 = 5v:GRM31CR71H475KA12L; CAP: 4.7E-6; ESR: 0.0; IRMS: 0.0; MANUFACTURER_NAME: MuRata; MANUFACTURER_PART_NUMBER: GRM31CR71H475KA12L; VDC: 50.0; VENDOR: MuRata
C5 C11 C17 C20' = 5v:C0805C103K5RACTU; CAP: 1.0E-8; ESR: 1.739; IRMS: 0.411; MANUFACTURER_NAME: Kemet; MANUFACTURER_PART_NUMBER: C0805C103K5RACTU; VDC: 50.0; VENDOR: Kemet
C6 C12 C18 C21' = 5v:10SVP330MX; CAP: 3.3E-4; DATASHEETURL: http://www.edc.sanyo.com/english/pdf/oscon/E32.pdf; ESR: 0.025; IRMS: 3.7; MANUFACTURER_NAME: Panasonic; MANUFACTURER_PART_NUMBER: 10SVP330MX; VDC: 10.0; VENDOR: Panasonic
C21 C25-C28 = rcl:C-US: CAPACITOR, American symbol
C23 C24 = SparkFun-Capacitors:10UF-16V-10%(TANT): CAP-00811 1206/EIA-3216 Tantalum capacitor; PROD_ID: CAP-00811
D1-D4 = 5v:PDS760-13; DATASHEETURL: www.diodes.com/datasheets/ds30477.pdf; IO: 7.0; MANUFACTURER_NAME: Diodes Inc.; MANUFACTURER_PART_NUMBER: PDS760-13; VENDOR: Diodes Inc.; VFATIO: 0.56; VRRM: 60.0
D5 D6 = SparkFun-LED:LED: LEDs Standard schematic elements and footprints for 5mm, 3mm, 1206, and 0603 sized LEDs. 5mm - Spark Fun Electronics SKU : COM-00529 (and others)
IC1 IC3 = microchip:PIC18F2*J53: PIC18F47J53 Family High-Performance USB Microcontrollers with nanoWatt XLP Technology Source: Data sheet <http://ww1.microchip.com/downloads/en/DeviceDoc/39964B.pdf>; MPN: PIC18F26J53-I/ML; OC_FARNELL: unknown; OC_NEWARK: 63R7829
IC2 = ic-package:DIL16: Dual In Line / Socket
J1-J6 = con-molex:22-?-03: CONNECTOR wire to board 2.54 mm (.1 inch) pitch header; OC_FARNELL: unknown; OC_NEWARK: unknown
J7-J12 = Son_of_Dark_Power:22-?-02: CONNECTOR wire to board 2.54 mm (.1 inch) pitch header; OC_FARNELL: 9731601; OC_NEWARK: unknown
J13 = Son_of_Dark_Power:22-?-04: CONNECTOR wire to board 2.54 mm (.1 inch) pitch header; OC_FARNELL: unknown; OC_NEWARK: unknown
L1-L4 = WE-HCC:WE-HCC: SMD High Current Cube Inductor WE-HCC - magnetically shieled - current capability up to 27A - excellent saturation characteristics -- filter choke for DC/DC converter -- single and polyphase buck converter -- filter choke for motor electronics; MPN: 7443331000; OC_FARNELL: 1848254; OC_NEWARK: 13T9771; PACKAGE: 1090; SUPPLIER: Wuerth Elektronik
LED1-LED4 = led:LED: LED OSRAM: - CHIPLED LG R971, LG N971, LY N971, LG Q971, LY Q971, LO R971, LY R971 LH N974, LH R974 LS Q976, LO Q976, LY Q976 LO Q996 - Hyper CHIPLED LW Q18S LB Q993, LB Q99A, LB R99A - SideLED LS A670, LO A670, LY A670, LG A670, LP A670 LB A673, LV A673, LT A673, LW A673 LH A674 LY A675 LS A676, LA A676, LO A676, LY A676, LW A676 LS A679, LY A679, LG A679 - Hyper Micro SIDELED® LS Y876, LA Y876, LO Y876, LY Y876 LT Y87S - SmartLED LW L88C, LW L88S LB L89C, LB L89S, LG L890 LS L89K, LO L89K, LY L89K LS L896, LA L896, LO L896, LY L896 - TOPLED LS T670, LO T670, LY T670, LG T670, LP T670 LSG T670, LSP T670, LSY T670, LOP T670, LYG T670 LG T671, LOG T671, LSG T671 LB T673, LV T673, LT T673, LW T673 LH T674 LS T676, LA T676, LO T676, LY T676, LB T676, LH T676, LSB T676, LW T676 LB T67C, LV T67C, LT T67C, LS T67K, LO T67K, LY T67K, LW E67C LS E67B, LA E67B, LO E67B, LY E67B, LB E67C, LV E67C, LT E67C LW T67C LS T679, LY T679, LG T679 LS T770, LO T770, LY T770, LG T770, LP T770 LB T773, LV T773, LT T773, LW T773 LH T774 LS E675, LA E675, LY E675, LS T675 LS T776, LA T776, LO T776, LY T776, LB T776 LHGB T686 LT T68C, LB T68C - Hyper Mini TOPLED® LB M676 - Mini TOPLED Santana® LG M470 LS M47K, LO M47K, LY M47K Source: http://www.osram.convergy.de LUXEON: - LUMILED® LXK2-PW12-R00, LXK2-PW12-S00, LXK2-PW14-U00, LXK2-PW14-V00 LXK2-PM12-R00, LXK2-PM12-S00, LXK2-PM14-U00 LXK2-PE12-Q00, LXK2-PE12-R00, LXK2-PE12-S00, LXK2-PE14-T00, LXK2-PE14-U00 LXK2-PB12-K00, LXK2-PB12-L00, LXK2-PB12-M00, LXK2-PB14-N00, LXK2-PB14-P00, LXK2-PB14-Q00 LXK2-PR12-L00, LXK2-PR12-M00, LXK2-PR14-Q00, LXK2-PR14-R00 LXK2-PD12-Q00, LXK2-PD12-R00, LXK2-PD12-S00 LXK2-PH12-R00, LXK2-PH12-S00 LXK2-PL12-P00, LXK2-PL12-Q00, LXK2-PL12-R00 Source: www.luxeon.com KINGBRIGHT: KA-3528ASYC Source: www.kingbright.com
LED5-LED9 = motherboard_i_autoroute:LED_LED: LED OSRAM: - CHIPLED LG R971, LG N971, LY N971, LG Q971, LY Q971, LO R971, LY R971 LH N974, LH R974 LS Q976, LO Q976, LY Q976 LO Q996 - Hyper CHIPLED LW Q18S LB Q993, LB Q99A, LB R99A - SideLED LS A670, LO A670, LY A670, LG A670, LP A670 LB A673, LV A673, LT A673, LW A673 LH A674 LY A675 LS A676, LA A676, LO A676, LY A676, LW A676 LS A679, LY A679, LG A679 - Hyper Micro SIDELED® LS Y876, LA Y876, LO Y876, LY Y876 LT Y87S - SmartLED LW L88C, LW L88S LB L89C, LB L89S, LG L890 LS L89K, LO L89K, LY L89K LS L896, LA L896, LO L896, LY L896 - TOPLED LS T670, LO T670, LY T670, LG T670, LP T670 LSG T670, LSP T670, LSY T670, LOP T670, LYG T670 LG T671, LOG T671, LSG T671 LB T673, LV T673, LT T673, LW T673 LH T674 LS T676, LA T676, LO T676, LY T676, LB T676, LH T676, LSB T676, LW T676 LB T67C, LV T67C, LT T67C, LS T67K, LO T67K, LY T67K, LW E67C LS E67B, LA E67B, LO E67B, LY E67B, LB E67C, LV E67C, LT E67C LW T67C LS T679, LY T679, LG T679 LS T770, LO T770, LY T770, LG T770, LP T770 LB T773, LV T773, LT T773, LW T773 LH T774 LS E675, LA E675, LY E675, LS T675 LS T776, LA T776, LO T776, LY T776, LB T776 LHGB T686 LT T68C, LB T68C - Hyper Mini TOPLED® LB M676 - Mini TOPLED Santana® LG M470 LS M47K, LO M47K, LY M47K Source: http://www.osram.convergy.de LUXEON: - LUMILED® LXK2-PW12-R00, LXK2-PW12-S00, LXK2-PW14-U00, LXK2-PW14-V00 LXK2-PM12-R00, LXK2-PM12-S00, LXK2-PM14-U00 LXK2-PE12-Q00, LXK2-PE12-R00, LXK2-PE12-S00, LXK2-PE14-T00, LXK2-PE14-U00 LXK2-PB12-K00, LXK2-PB12-L00, LXK2-PB12-M00, LXK2-PB14-N00, LXK2-PB14-P00, LXK2-PB14-Q00 LXK2-PR12-L00, LXK2-PR12-M00, LXK2-PR14-Q00, LXK2-PR14-R00 LXK2-PD12-Q00, LXK2-PD12-R00, LXK2-PD12-S00 LXK2-PH12-R00, LXK2-PH12-S00 LXK2-PL12-P00, LXK2-PL12-Q00, LXK2-PL12-R00 Source: www.luxeon.com KINGBRIGHT: KA-3528ASYC Source: www.kingbright.com
PROG. = con-molex:22-23-2061: .100" (2.54mm) Center Header - 6 Pin; MF: MOLEX; MPN: 22-23-2061; OC_FARNELL: 1462922; OC_NEWARK: 27C1933
Q1-Q4 = transistor-small-signal:BSS123: N-CHANNEL MOS FET
R1-R16 R19-R25 = rcl:R-US_: RESISTOR, American symbol
U1 U2 U$2 U$4 = 5v:TPS5450DDAR; DATASHEETURL: http://www.ti.com/product/tps5450; FREQUENCY: 500000.0; IMAX: 5.0; MANUFACTURER_NAME: Texas Instruments; MANUFACTURER_PART_NUMBER: TPS5450DDA; MKTG_PACKAGE: TPS5450; NSID: TPS5450DDAR; PACKAGE: TPS5450; VENDOR: Texas Instruments
U3 = NSC-LMS8117AMP:LMS8117AMP-3.3: Low-Dropout Linear Regulator; MPN: LMS8117AMP-3.3; OC_FARNELL: 1469032; OC_NEWARK: 41K3020; PACKAGE: SOT-223-3; SUPPLIER: National Semiconductor
U$1 = Son_of_Dark_Powersch:BEAGLE_BONE_BLACK_CAPE
U$5-U$7 = Parts4Class:MC32882_SW

## Net classes
0 default: width 0.203 mm, drill 0.508 mm, clearance 0.254 mm

## Board
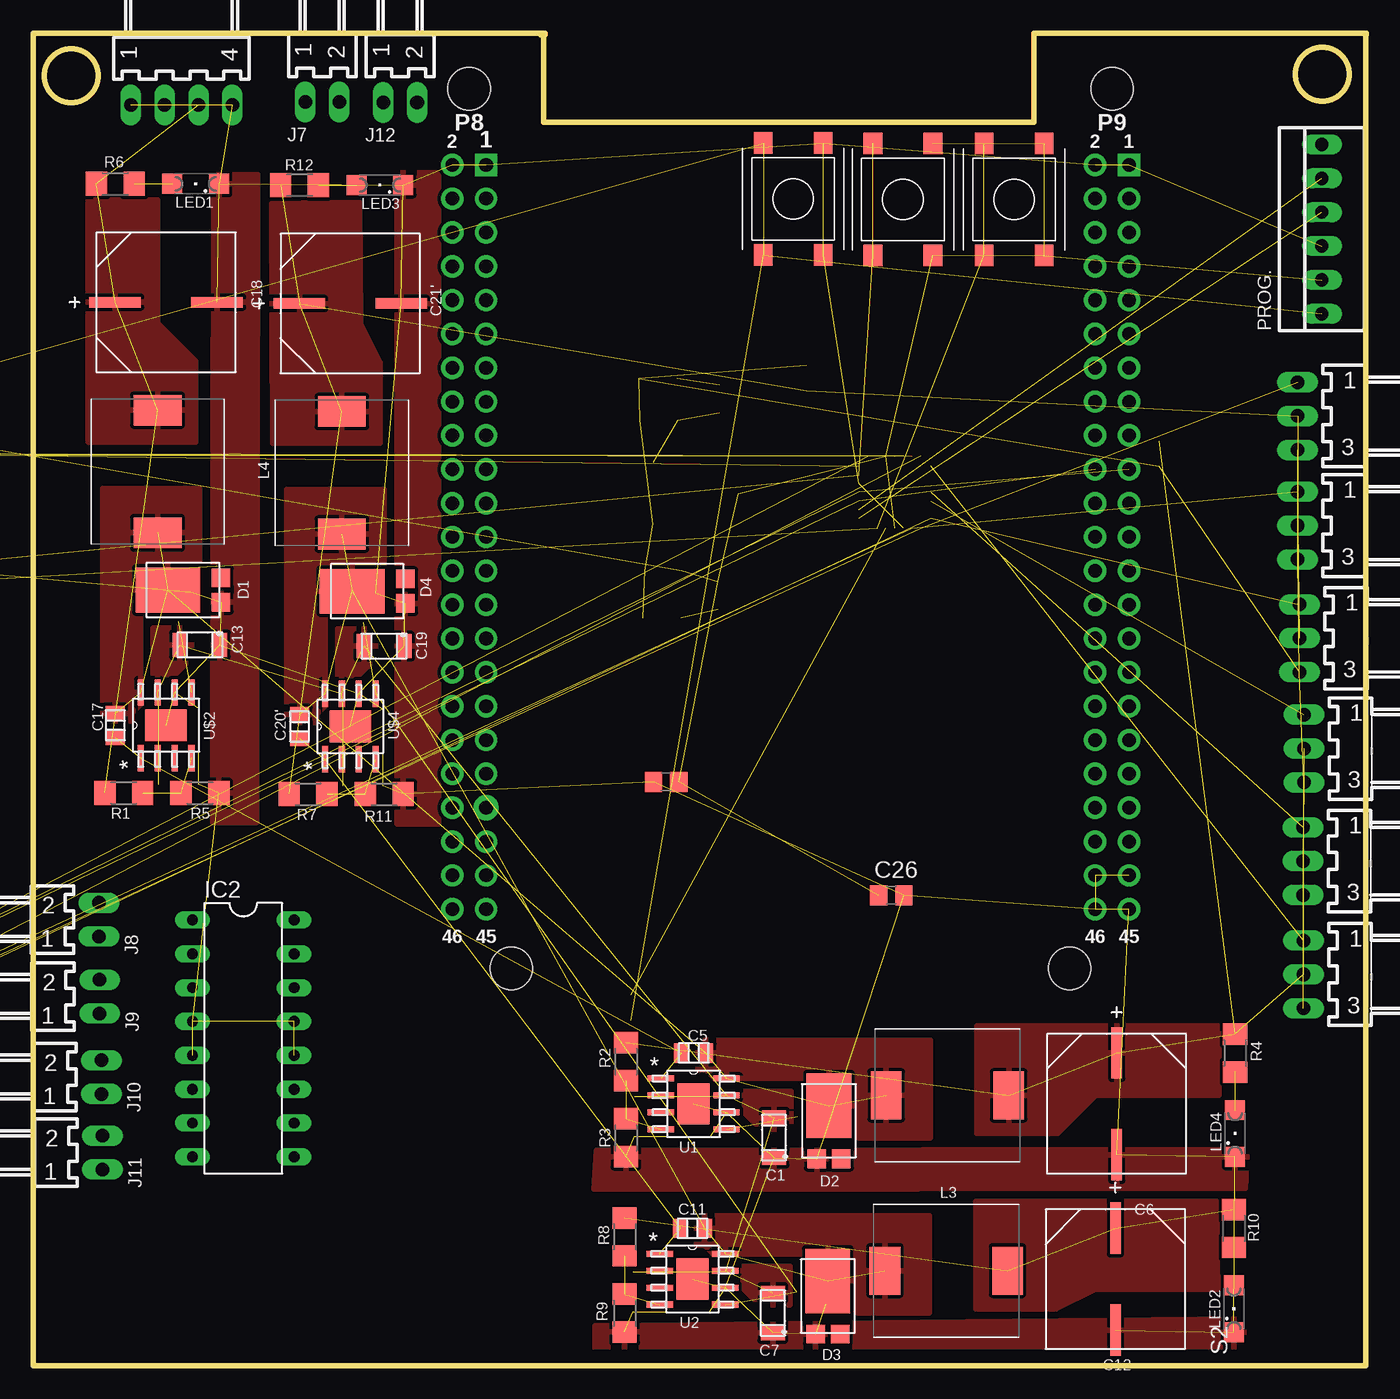
[diagram p9: board, top side]
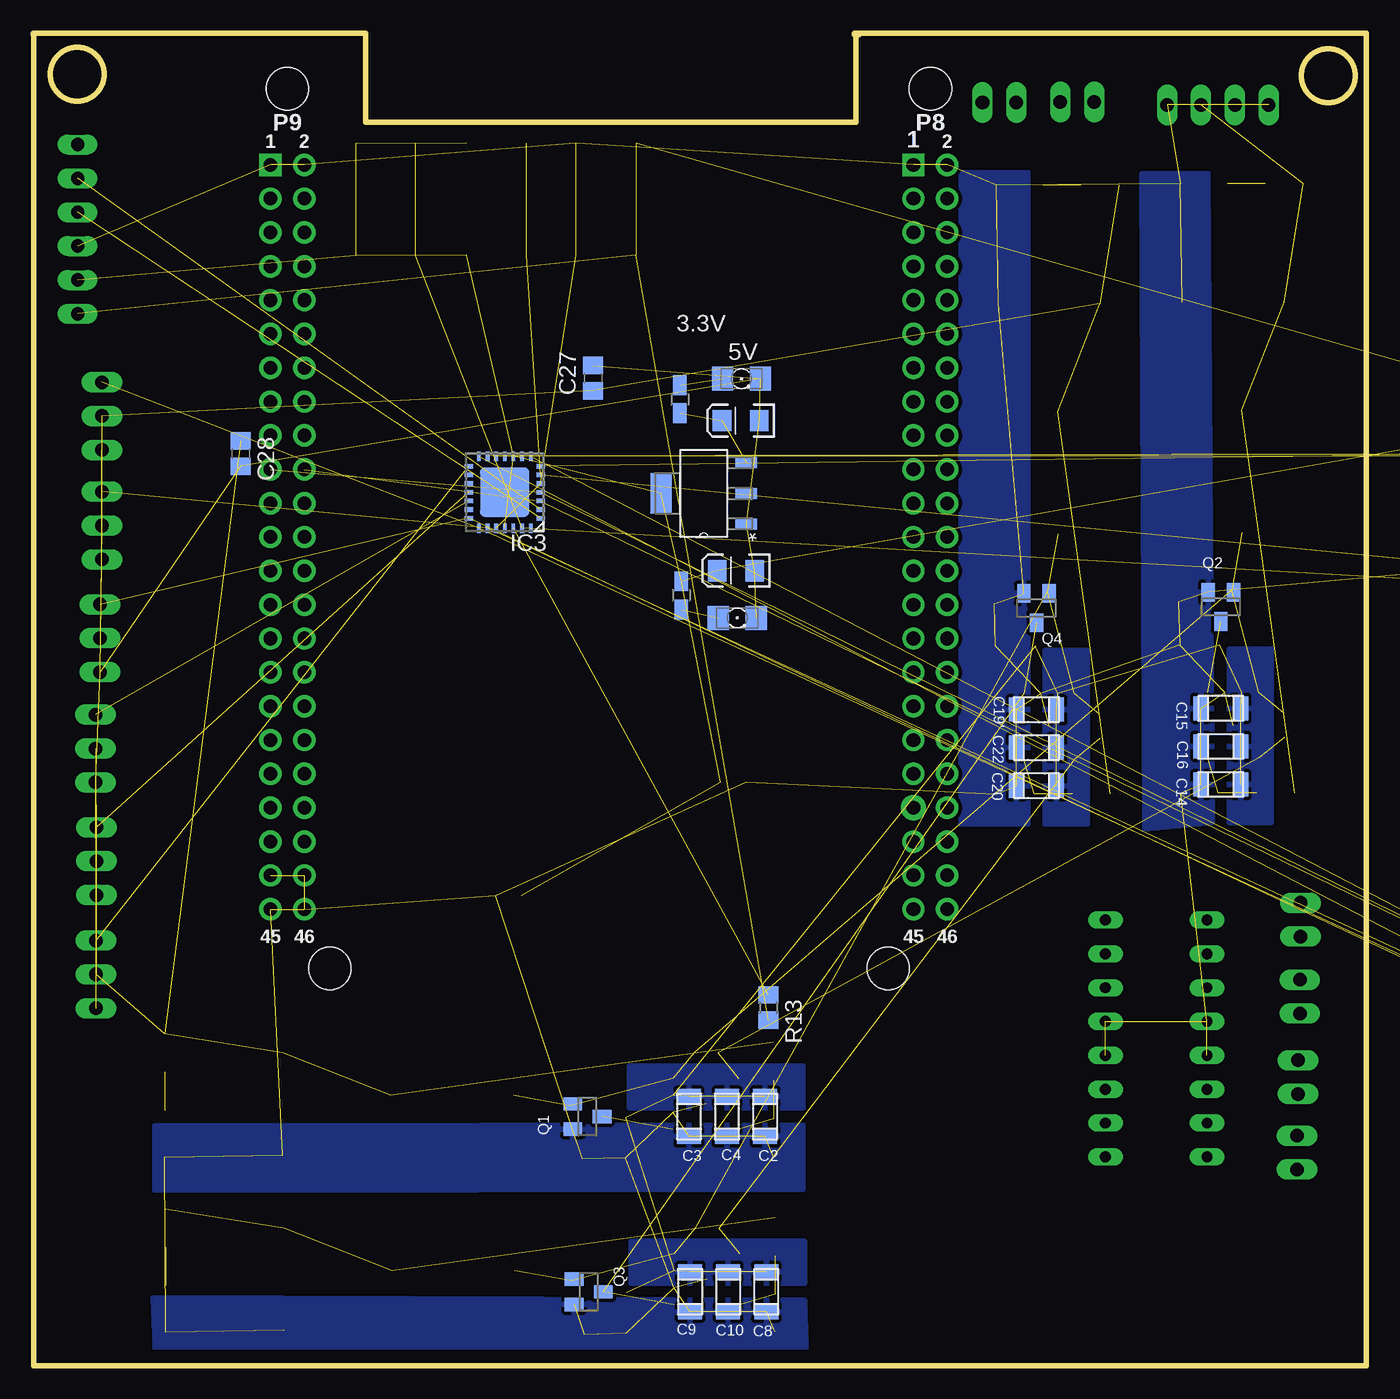
[diagram p10: board, bottom side, seen from below]

Size 100.05 x 100 mm. Coordinates in mm from the lower left corner, seen from the top.
Outline: 100,100 100,0 0,0 0,100 38.42,100 38.42,99.89
Outline: 38.09,99.89 38.31,99.89 38.31,93.32 75.09,93.32 75.09,99.89
Outline: 75.09,100 100.05,100 100.05,99.89
Outline: circle at 96.76,96.93 radius 2
Outline: circle at 2.84,96.82 radius 2
Copper layers (1*16): Top 0.035mm / dielectric 1.5mm / Bottom 0.035mm
Design rules "default": minimum track width 10mil, minimum drill 24mil, track to track 8mil, track to pad 8mil, pad to pad 8mil, via to via 8mil, smd to smd 8mil, copper to edge 40mil, drill to drill 8mil, minimum pad ring 10mil, minimum via ring 8mil, stop-mask expansion 4mil, vias tented up to drill 0mil, thermal gap 10mil

### Footprints (pad centres in the part's own frame; a part is rotated, then mirrored left to right if it is on the bottom)
1206 = smd 1.118 x 1.803: 1 -1.499,0; 2 1.499,0
0805 = smd 1.118 x 1.448: 1 -0.902,0; 2 0.902,0
SM_RADIAL_10AMM = smd 3.861 x 0.787: 1 -3.823,0; 2 3.823,0
C0805 = smd 1.3 x 1.5: 1 -0.95,0; 2 0.95,0
EIA3216 = smd 1.4 x 1.6: A 1.4,0; C -1.4,0
POWERDI5 = smd 1.397 x 1.397: 1 -0.92,-2.857; 2 0.92,-2.857 | smd 3.353 x 4.851: 3 0,1.13
FKIT-LED-1206 = smd 1.6 x 1.803: A -1.422,0; C 1.422,0
QFN28-ML_6X6MM = smd 0.7 x 0.35: 1 -2.7,1.95; 2 -2.7,1.3; 3 -2.7,0.65; 4 -2.7,0; 5 -2.7,-0.65; 6 -2.7,-1.3; 7 -2.7,-1.95; 15 2.7,-1.95; 16 2.7,-1.3; 17 2.7,-0.65; 18 2.7,0; 19 2.7,0.65; 20 2.7,1.3; 21 2.7,1.95 | smd 0.35 x 0.7: 8 -1.95,-2.7; 9 -1.3,-2.7; 10 -0.65,-2.7; 11 0,-2.7; 12 0.65,-2.7; 13 1.3,-2.7; 14 1.95,-2.7; 22 1.95,2.7; 23 1.3,2.7; 24 0.65,2.7; 25 0,2.7; 26 -0.65,2.7; 27 -1.3,2.7; 28 -1.95,2.7 | smd 3.7 x 3.7: EXP 0,0
DIL16 = drill 0.813 long: 1 -8.89,-3.81; 2 -6.35,-3.81; 3 -3.81,-3.81; 4 -1.27,-3.81; 5 1.27,-3.81; 6 3.81,-3.81; 7 6.35,-3.81; 8 8.89,-3.81; 9 8.89,3.81; 10 6.35,3.81; 11 3.81,3.81; 12 1.27,3.81; 13 -1.27,3.81; 14 -3.81,3.81; 15 -6.35,3.81; 16 -8.89,3.81
7395-03 = drill 1.016 long: 1 2.54,0; 2 0,0; 3 -2.54,0
7395-02 = drill 1.016 long: 1 1.27,0; 2 -1.27,0
7395-04 = drill 1.016 long: 1 3.81,0; 2 1.27,0; 3 -1.27,0; 4 -3.81,0
WE-HCC_1090 = smd 2.3 x 3.6: 1 -4.6,0; 2 4.6,0
SML1206 = smd 1.5 x 1.5: A 1.75,0; C -1.75,0
LED_CHIPLED_1206 = smd 1.5 x 1.5: A 0,-1.75; C 0,1.75
22-23-2061 = drill 1 long: 1 -6.35,0; 2 -3.81,0; 3 -1.27,0; 4 1.27,0; 5 3.81,0; 6 6.35,0
SOT23 = smd 1 x 1.4: 1 -0.95,-1.1; 2 0.95,-1.1; 3 0,1.1
R1206 = smd 1.6 x 1.803: 1 -1.422,0; 2 1.422,0
R0805 = smd 1.3 x 1.5: 1 -0.95,0; 2 0.95,0
R0805W = smd 1.5 x 1: 1 -1.052,0; 2 1.052,0
M0805 = smd 1.3 x 1.6: 1 -0.95,0; 2 0.95,0
R-PDSO-G8 = smd 1.981 x 0.457: 1 -2.464,1.905; 2 -2.464,0.635; 3 -2.464,-0.635; 4 -2.464,-1.905; 5 2.464,-1.905; 6 2.464,-0.635; 7 2.464,0.635; 8 2.464,1.905 | smd 2.388 x 3.099: 9 0,0
SOT230P696X180-4N = smd 1.6 x 0.838: 1 -3.2,2.311; 2 -3.2,0; 3 -3.2,-2.311 | smd 1.6 x 3.023: 4 3.2,0
BEAGLE_BONE_BLACK_CAPE = drill 1.016 pad 1.676 square: P8.1 20.32,50.165; P9.1 20.32,1.905 | drill 1.016 pad 1.676: P8.2 20.32,52.705; P8.3 22.86,50.165; P8.4 22.86,52.705; P8.5 25.4,50.165; P8.6 25.4,52.705; P8.7 27.94,50.165; P8.8 27.94,52.705; P8.9 30.48,50.165; P8.10 30.48,52.705; P8.11 33.02,50.165; P8.12 33.02,52.705; P8.13 35.56,50.165; P8.14 35.56,52.705; P8.15 38.1,50.165; P8.16 38.1,52.705; P8.17 40.64,50.165; P8.18 40.64,52.705; P8.19 43.18,50.165; P8.20 43.18,52.705; P8.21 45.72,50.165; P8.22 45.72,52.705; P8.23 48.26,50.165; P8.24 48.26,52.705; P8.25 50.8,50.165; P8.26 50.8,52.705; P8.27 53.34,50.165; P8.28 53.34,52.705; P8.29 55.88,50.165; P8.30 55.88,52.705; P8.31 58.42,50.165; P8.32 58.42,52.705; P8.33 60.96,50.165; P8.34 60.96,52.705; P8.35 63.5,50.165; P8.36 63.5,52.705; P8.37 66.04,50.165; P8.38 66.04,52.705; P8.40 68.58,52.705; P8.41 71.12,50.165; P8.42 71.12,52.705; P8.43 73.66,50.165; P8.44 73.66,52.705; P8.45 76.2,50.165; P8.46 76.2,52.705; P9.2 20.32,4.445; P9.3 22.86,1.905; P9.4 22.86,4.445; P9.5 25.4,1.905; P9.6 25.4,4.445; P9.7 27.94,1.905; P9.8 27.94,4.445; P9.9 30.48,1.905; P9.10 30.48,4.445; P9.11 33.02,1.905; P9.12 33.02,4.445; P9.13 35.56,1.905; P9.14 35.56,4.445; P9.15 38.1,1.905; P9.16 38.1,4.445; P9.17 40.64,1.905; P9.18 40.64,4.445; P9.19 43.18,1.905; P9.20 43.18,4.445; P9.21 45.72,1.905; P9.22 45.72,4.445; P9.23 48.26,1.905; P9.24 48.26,4.445; P9.25 50.8,1.905; P9.26 50.8,4.445; P9.27 53.34,1.905; P9.28 53.34,4.445; P9.29 55.88,1.905; P9.30 55.88,4.445; P9.31 58.42,1.905; P9.32 58.42,4.445; P9.33 60.96,1.905; P9.34 60.96,4.445; P9.35 63.5,1.905; P9.36 63.5,4.445; P9.37 66.04,1.905; P9.38 66.04,4.445; P9.39 68.58,1.905; P9.40 68.58,4.445; P9.41 71.12,1.905; P9.42 71.12,4.445; P9.43 73.66,1.905; P9.44 73.66,4.445; P9.45 76.2,1.905; P9.46 76.2,4.445 | drill 1.016 pad 1.88: P8.39 68.58,50.165 | hole 3.175: 14.605,3.175; 80.645,6.35; 80.645,48.26; 14.605,51.435
MC32882_FINAL = smd 1.6 x 1.4: P$1 -4.2,-2.25; P$2 -4.2,2.25; P$3 4.2,2.25; P$4 4.2,-2.25

### Placement (x,y rotation side)
C1  55.6,17.11 90 top
C2  45.12,18.69 90 bottom
C3  50.84,18.69 90 bottom
C4  47.98,18.69 90 bottom
C5  49.57,23.45 0 top
C6  81.32,19.64 270 top
C7  55.51,3.94 90 top
C8  45.03,5.53 90 bottom
C9  50.75,5.53 90 bottom
C10  47.89,5.53 90 bottom
C11  49.48,10.29 0 top
C12  81.23,6.48 270 top
C13  12.51,54.09 180 top
C14  10.92,43.61 0 bottom
C15  10.92,49.33 0 bottom
C16  10.92,46.47 0 bottom
C17  6.16,48.06 90 top
C18  9.96,79.81 0 top
C19  26.34,54 180 top
C19'  24.75,49.24 0 bottom
C20  24.75,43.52 0 bottom
C20'  19.99,47.97 90 top
C21  -48.34,62 180 bottom  (outside the outline)
C21'  23.8,79.72 0 top
C22  24.75,46.38 0 bottom
C23  46.96,70.93 180 bottom
C24  47.3,59.67 180 bottom
C25  47.5,43.82 180 top
C26  64.41,35.3 0 top
C27  58.03,74.12 90 bottom
C28  84.48,68.45 270 bottom
D1  11.23,58.22 90 top
D2  59.73,18.38 0 top
D3  59.64,5.21 0 top
D4  25.07,58.13 90 top
D5  47.2,56.12 0 bottom
D6  46.89,74.07 0 bottom
IC1  -123.9,-27.18 0 top  (outside the outline)
IC2  15.76,24.55 270 top
IC3  64.66,65.55 180 bottom
J1  94.9,71.27 90 top
J2  94.9,63.05 90 top
J3  95.04,54.59 90 top
J4  95.38,46.31 90 top
J5  95.31,37.86 90 top
J6  95.34,29.36 90 top
J7  21.69,94.84 180 top
J8  4.93,33.47 270 top
J9  4.98,27.69 270 top
J10  5.11,21.65 270 top
J11  5.19,15.98 270 top
J12  27.54,94.82 180 top
J13  11.13,94.63 180 top
L1  68.62,20.28 0 top
L2  9.33,67.11 90 top
L3  68.53,7.12 0 top
L4  23.16,67.02 90 top
LED1  12.19,88.7 180 top
LED2  90.12,4.26 90 top
LED3  26.02,88.61 180 top
LED4  90.21,17.42 90 top
LED5  -15.55,62.3 180 top  (outside the outline)
LED6  -17.65,62.34 180 top  (outside the outline)
LED7  -19.68,62.34 180 top  (outside the outline)
LED8  -21.71,62.34 180 top  (outside the outline)
LED9  -23.74,62.34 180 top  (outside the outline)
PROG.  96.72,85.3 90 top
Q1  58.46,18.69 270 bottom
Q2  10.92,56.95 180 bottom
Q3  58.37,5.53 270 bottom
Q4  24.75,56.86 180 bottom
R1  6.79,42.98 180 top
R2  44.49,22.82 90 top
R3  44.49,17.11 90 top
R4  90.21,23.45 90 top
R5  12.51,42.98 180 top
R6  6.16,88.7 180 top
R7  20.62,42.89 180 top
R8  44.4,9.66 90 top
R9  44.4,3.94 90 top
R10  90.12,10.29 90 top
R11  26.34,42.89 180 top
R12  19.99,88.61 180 top
R13  44.88,26.86 270 bottom
R14  -50.67,77.37 0 bottom  (outside the outline)
R15  51.41,57.81 270 bottom
R16  51.52,72.53 270 bottom
R19  -26.84,58.62 90 bottom  (outside the outline)
R20  -30.93,58.75 90 bottom  (outside the outline)
R21  -15.28,67.52 90 top  (outside the outline)
R22  -17.57,67.5 90 top  (outside the outline)
R23  -19.63,67.5 90 top  (outside the outline)
R24  -21.71,67.47 90 top  (outside the outline)
R25  -23.82,67.37 90 top  (outside the outline)
U1  49.57,19.64 0 top
U2  49.48,6.48 0 top
U3  49.73,65.46 180 bottom
U$1  84.15,110.45 270 bottom
U$2  9.96,48.06 90 top
U$4  23.8,47.97 90 top
U$5  57.04,87.56 90 top
U$6  73.62,87.52 90 top
U$7  65.28,87.53 90 top

### Tracks (layer width: path | path; a pad name or v marks a point on that pad's centre or on a via)
3.3V  (14 unrouted)
+5V  (2 unrouted)
BOOT_5  (3 unrouted)
BOOT_MOTOR  (3 unrouted)
ENA_1  (1 unrouted)
ENA_5  (1 unrouted)
ENA_MOTOR  (3 unrouted)
GND  (74 unrouted)
  pour Bottom: 42.26,18.06 90.93,17.99 90.93,13.14 42.26,13.21
  pour Top: 42.26,16.15 91.14,16.22 90.97,13.29 42.09,13.21
  pour Bottom: 42.17,4.9 91.04,5.1 90.87,0.59 42,0.39
  pour Top: 42.17,2.99 90.92,3.51 90.78,0.32 42.17,0.39
  pour Bottom: 11.55,40.75 11.88,89.5 16.84,89.47 16.61,40.26
  pour Top: 13.46,40.75 13.55,89.41 16.86,89.41 16.77,40.75
  pour Bottom: 25.38,40.66 25.38,89.53 30.44,89.53 30.44,40.66
  pour Top: 27.29,40.66 27.29,89.54 30.44,89.54 30.44,40.66
IO3  (1 unrouted)
IO4  (2 unrouted)
IO5  (1 unrouted)
IO6  (2 unrouted)
IO7  (1 unrouted)
MCLR  (5 unrouted)
MCLR'  (1 unrouted)
N$1  (1 unrouted)
N$2  (1 unrouted)
N$3  (1 unrouted)
N$4  (1 unrouted)
N$5  (1 unrouted)
N$6  (1 unrouted)
N$7  (1 unrouted)
N$8  (1 unrouted)
N$9  (1 unrouted)
N$10  (1 unrouted)
N$13  (1 unrouted)
N$25  (1 unrouted)
N$31  (1 unrouted)
OC1  (2 unrouted)
OC2  (2 unrouted)
OC3  (2 unrouted)
OC4  (1 unrouted)
OC5  (1 unrouted)
OC6  (1 unrouted)
PGC1  (1 unrouted)
PGD1  (1 unrouted)
PH_5  (7 unrouted)
  pour Top: 49.88,24.41 49.88,22.18 50.52,22.18 51.15,21.55 57.82,21.55 61,17.11 67.35,17.11 67.35,24.41
  pour Top: 5.2,48.37 7.42,48.37 7.42,49.01 8.06,49.64 8.06,56.31 12.51,59.49 12.51,65.84 5.2,65.84
PH_MOTOR  (7 unrouted)
  pour Top: 49.79,11.25 49.79,9.02 50.43,9.02 51.06,8.39 57.73,8.39 60.91,3.94 67.26,3.94 67.26,11.25
  pour Top: 19.03,48.28 21.26,48.28 21.26,48.92 21.89,49.55 21.89,56.22 26.34,59.4 26.34,65.75 19.03,65.75
SCL  (2 unrouted)
SDA  (2 unrouted)
SWITCH_1  (3 unrouted)
SWITCH_2  (3 unrouted)
VCC  (19 unrouted)
  pour Bottom: 42.26,19.33 55.28,19.33 55.28,22.5 42.26,22.5
  pour Top: 53.38,19.01 53.38,20.6 56.87,20.6 56.87,17.74 54.65,17.74
  pour Bottom: 42.17,6.17 55.19,6.17 55.19,9.34 42.17,9.34
  pour Top: 53.29,5.85 53.29,7.44 56.78,7.44 56.78,4.58 54.56,4.58
  pour Bottom: 10.28,40.75 10.28,53.77 7.11,53.77 7.11,40.75
  pour Top: 10.6,51.87 9.01,51.87 9.01,55.36 11.87,55.36 11.87,53.14
  pour Bottom: 24.11,40.66 24.11,53.68 20.94,53.68 20.94,40.66
  pour Top: 24.43,51.78 22.84,51.78 22.84,55.27 25.7,55.27 25.7,53.05
VOUT_LOGIC  (3 unrouted)
VOUT_MOTOR  (5 unrouted)
  pour Top: 4.12,69.33 12.19,69.33 12.19,75.36 9.33,78.22 9.33,87.49 4.12,87.49
VOUT_SERVOLEFT  (7 unrouted)
  pour Top: 70.75,12.32 70.75,4.26 76.78,4.26 79.77,5.72 88.91,5.72 88.78,12.32
  pour Top: 70.84,25.49 70.84,17.42 76.87,17.42 79.73,20.28 89,20.28 89,25.49
VOUT_SERVORIGHT  (7 unrouted)
  pour Top: 17.95,69.24 26.02,69.24 26.02,75.27 24.56,78.26 24.5,87.34 17.89,87.21
VSNS1_MOTOR  (2 unrouted)
VSNS1_MOTOR1  (2 unrouted)
VSNS_1  (2 unrouted)
VSNS_5  (2 unrouted)
VSS  (12 unrouted)

### Text on the board
tPlace: User LEDs | S1 | S2
bPlace: 3.3V | 5V